# EAGLE schematic schem (EAGLE 9.6.2)
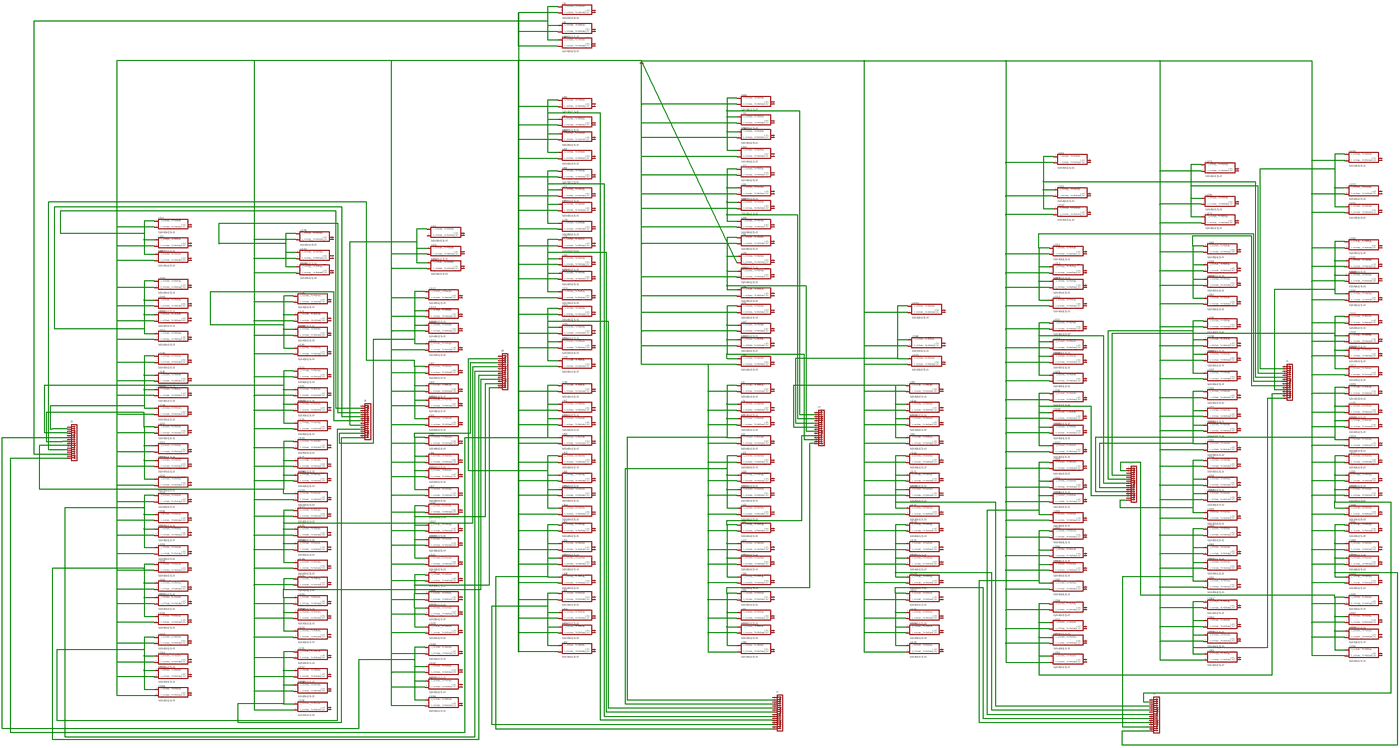
[diagram p0: schematic, sheet 1, overview]
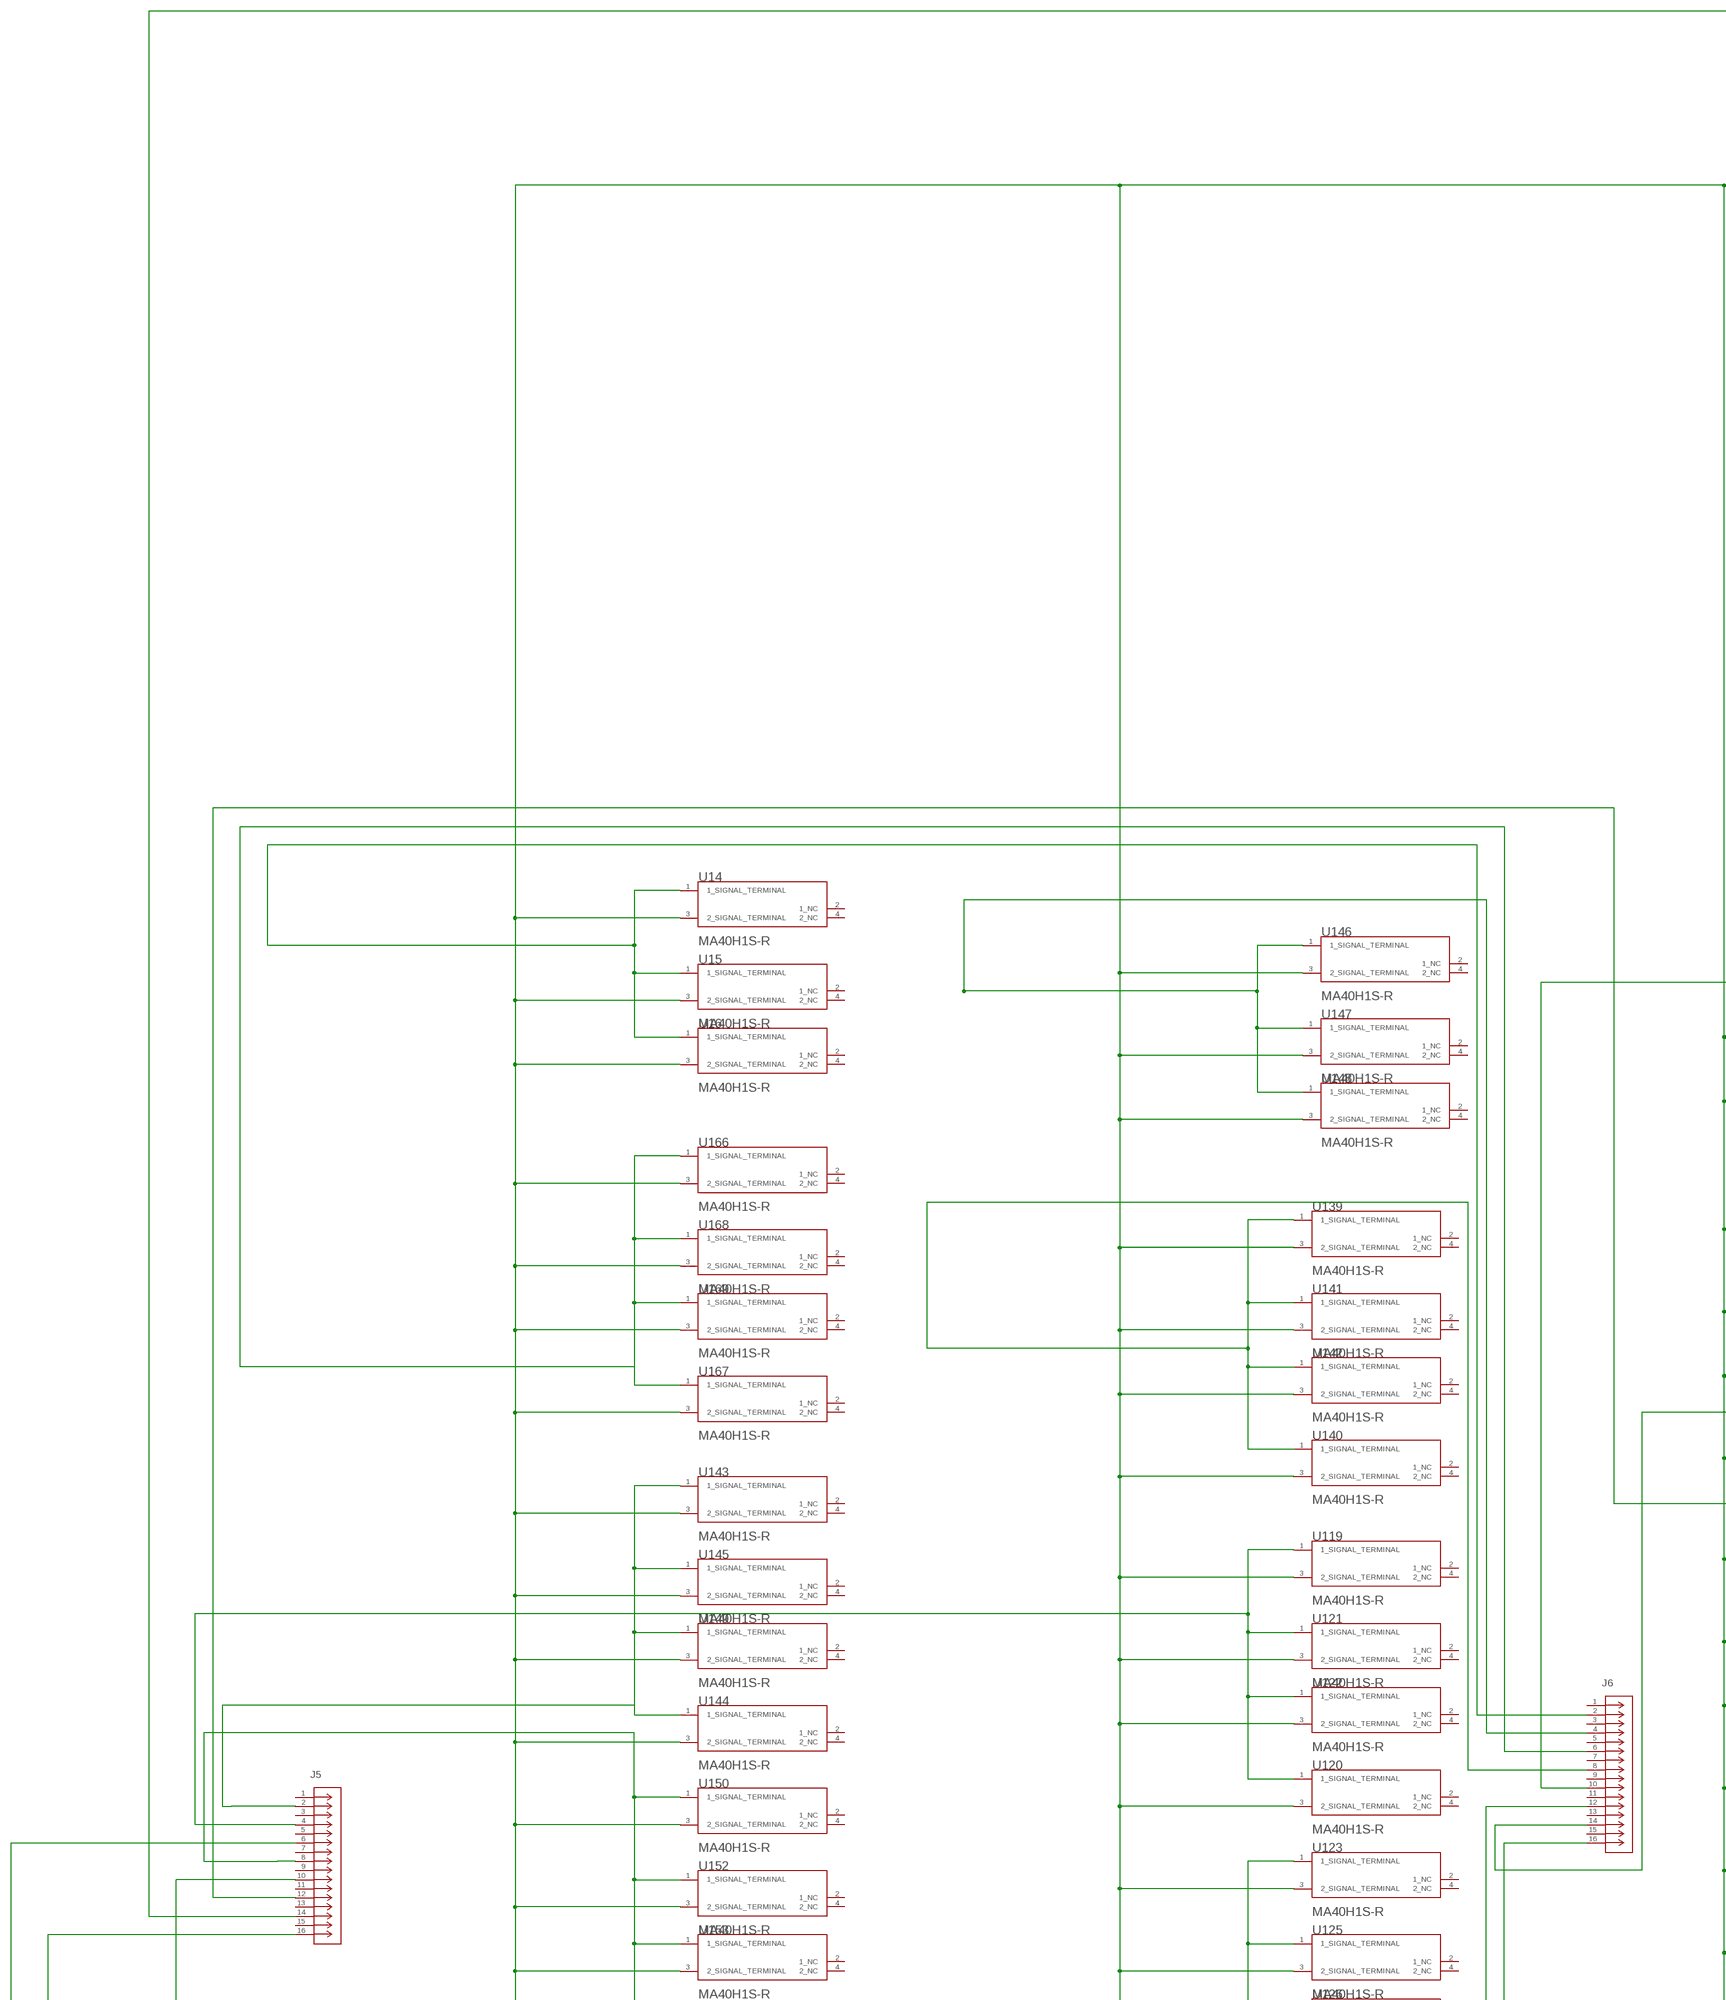
[diagram p1: schematic, sheet 1, part 1 of 8]
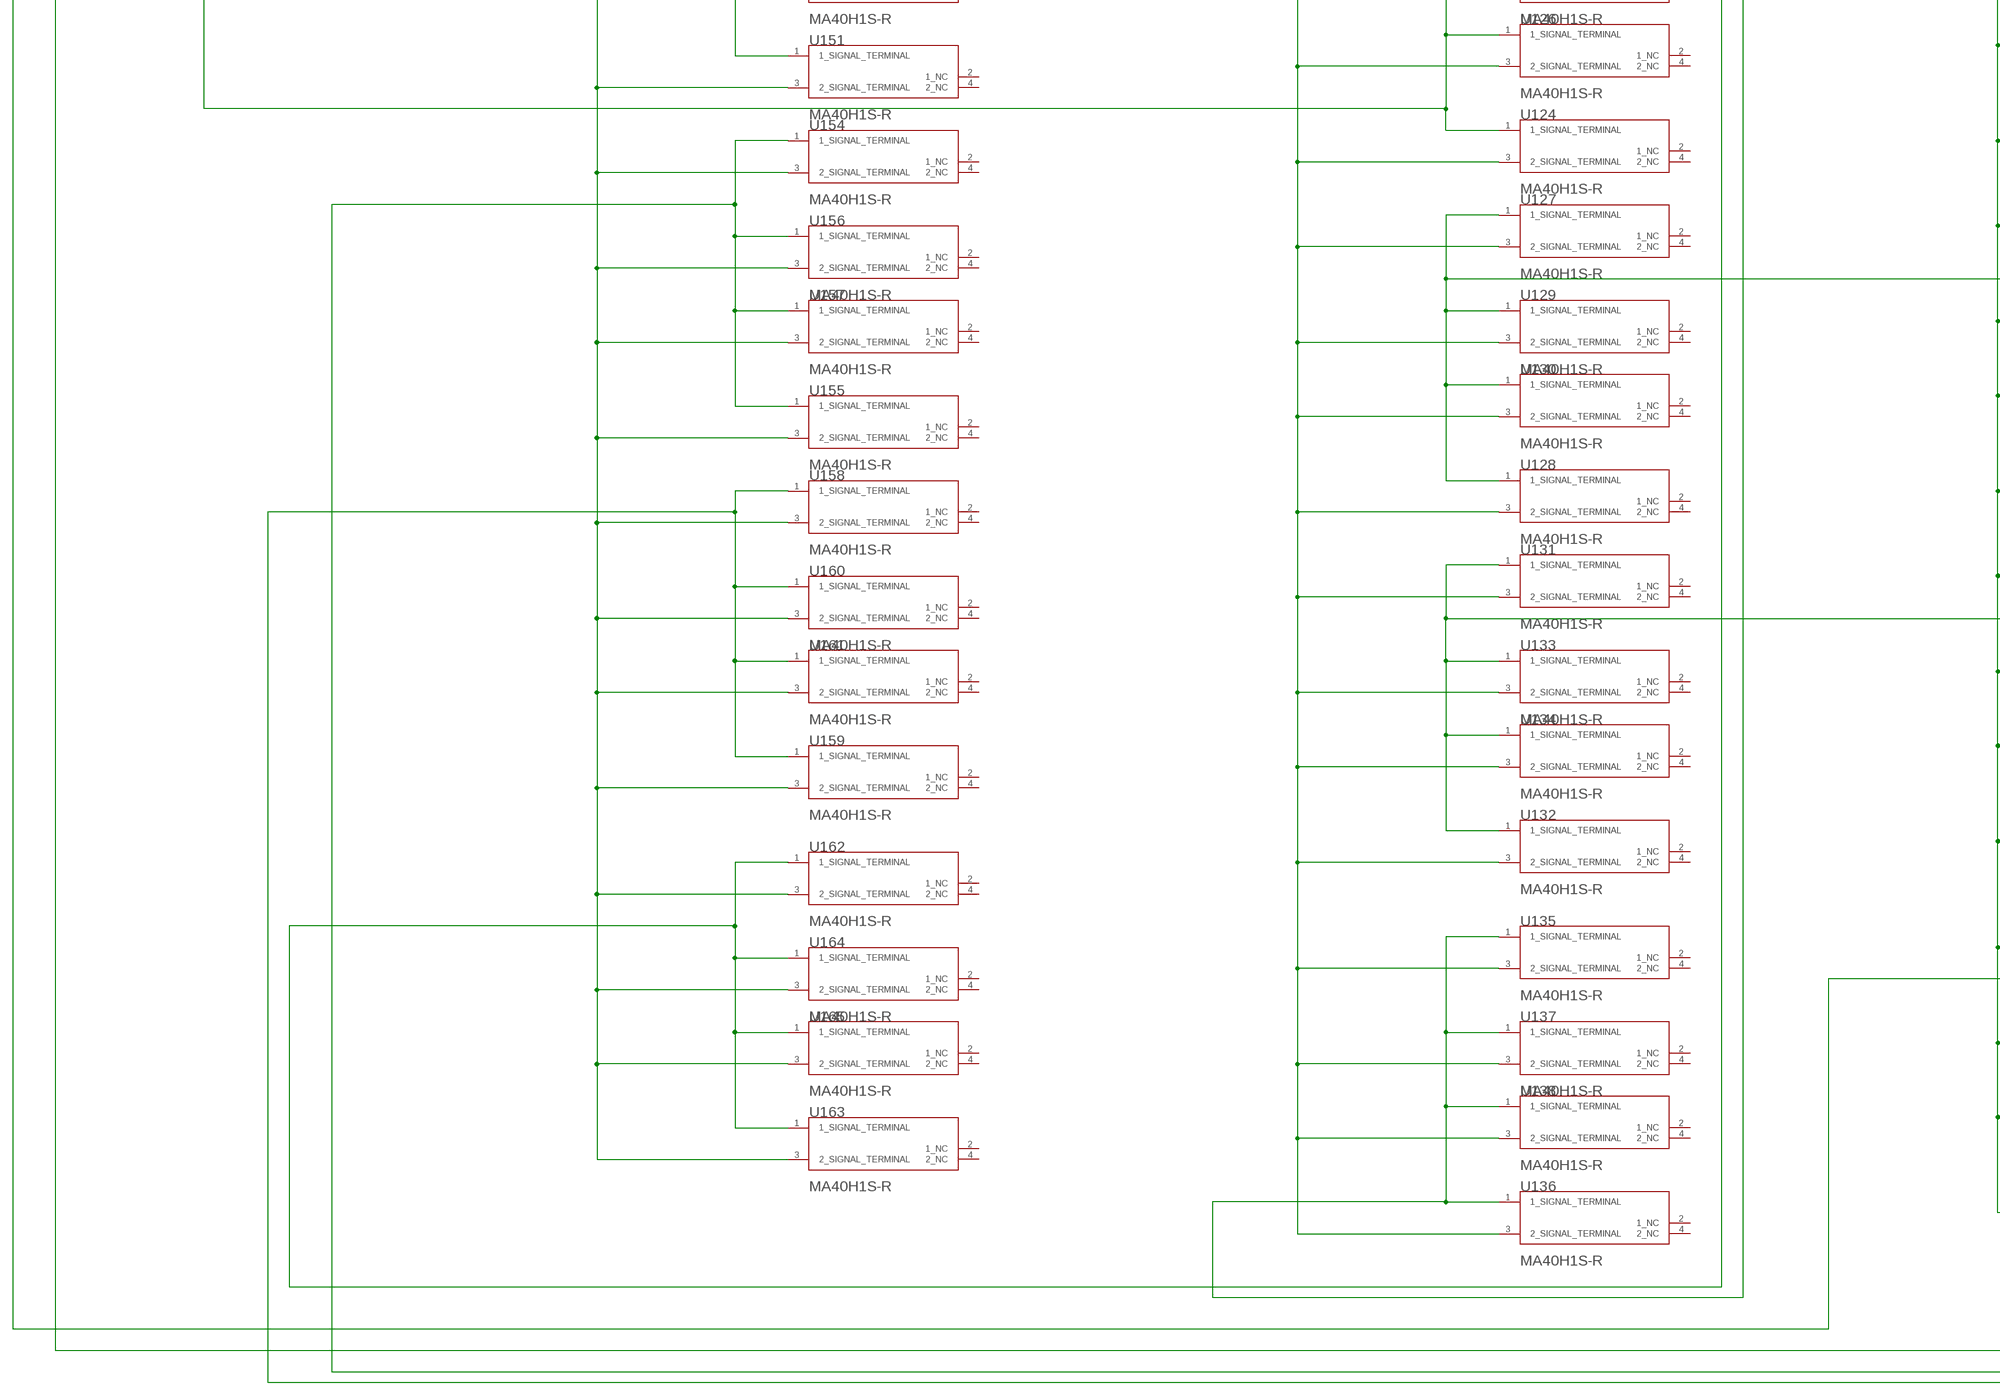
[diagram p2: schematic, sheet 1, part 2 of 8]
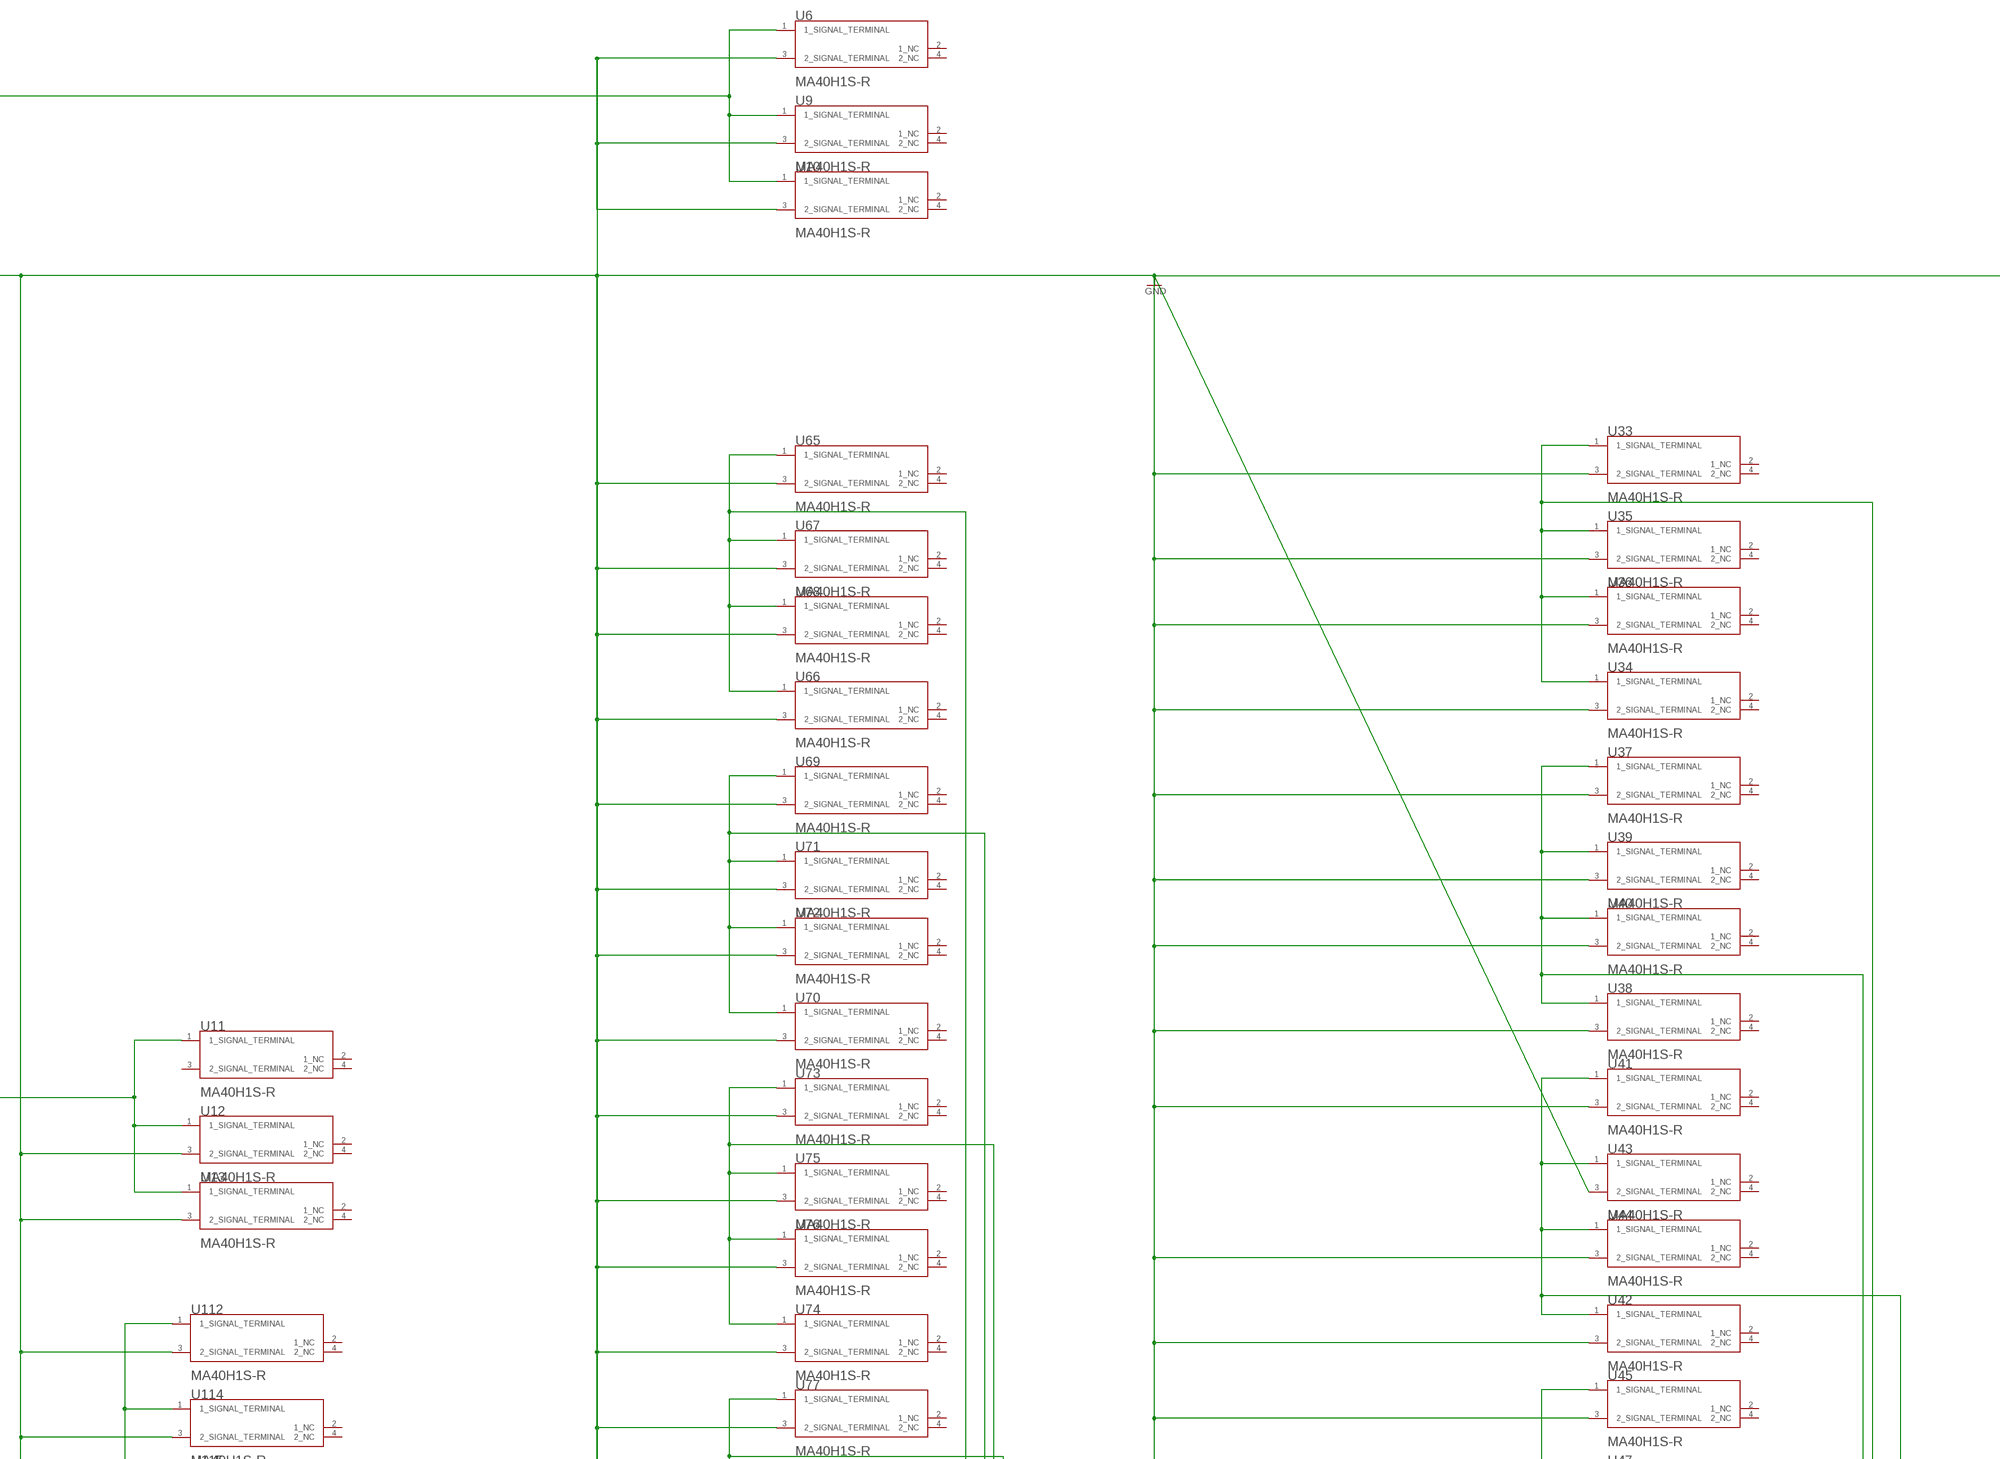
[diagram p3: schematic, sheet 1, part 3 of 8]
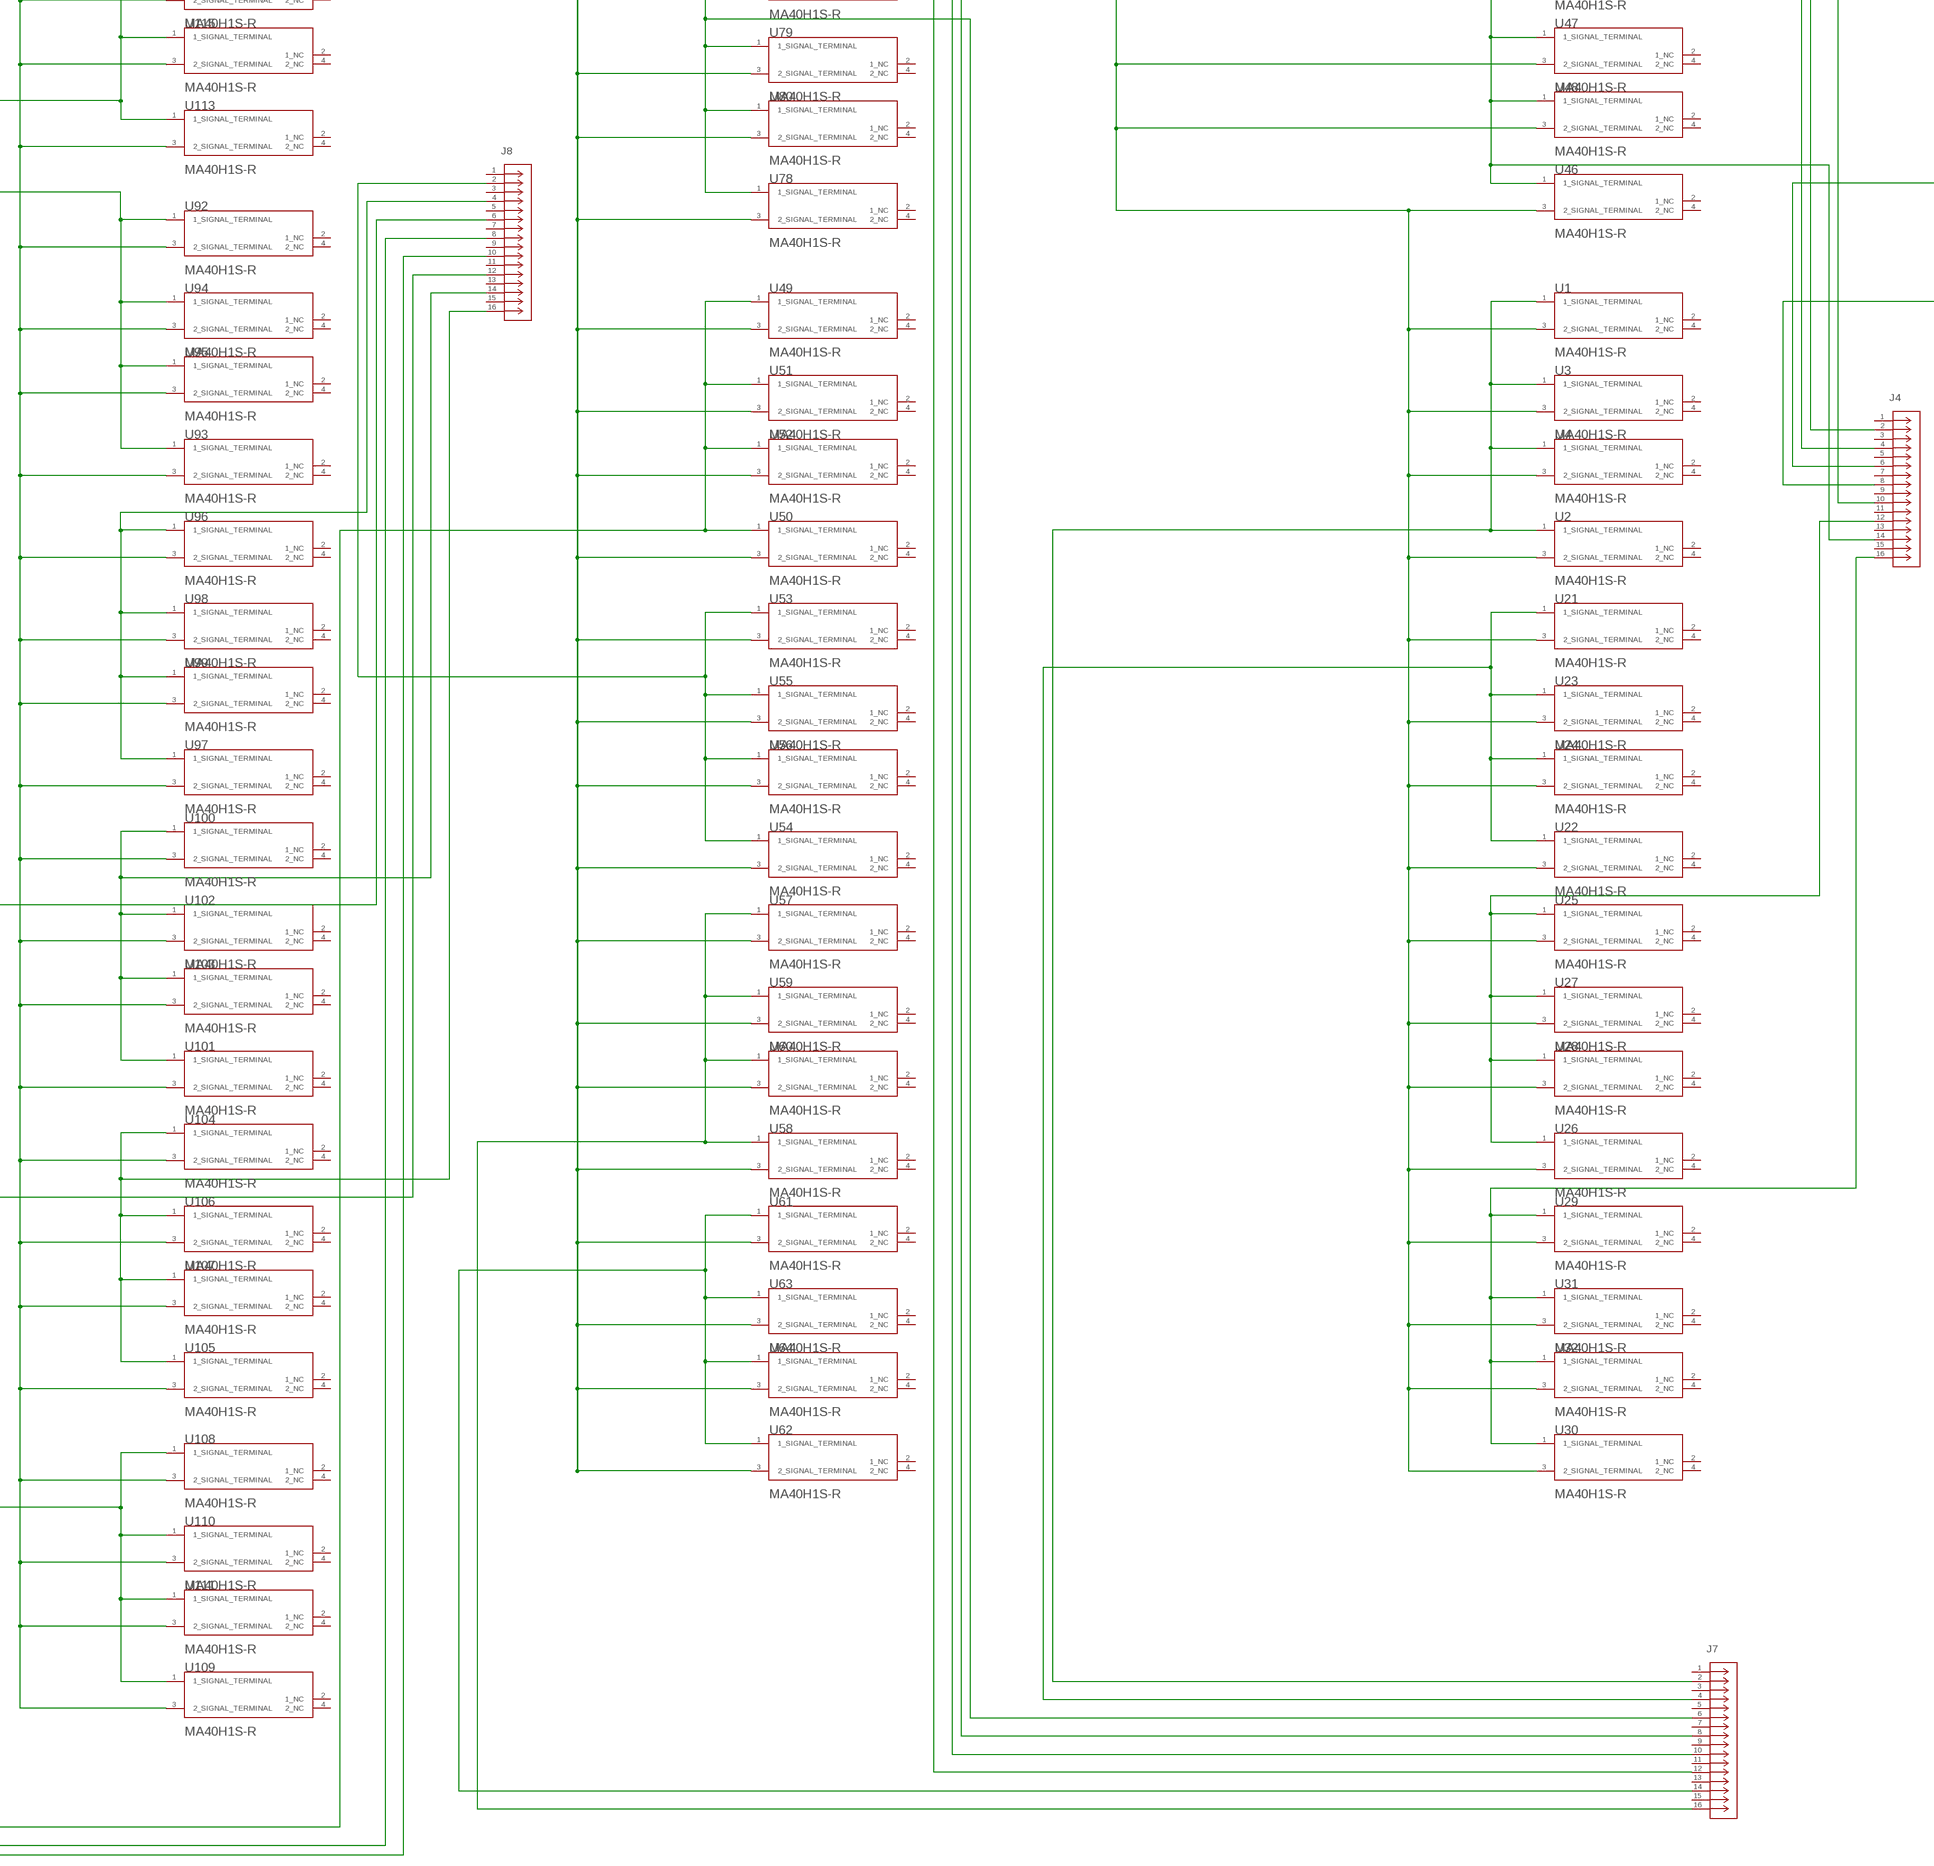
[diagram p4: schematic, sheet 1, part 4 of 8]
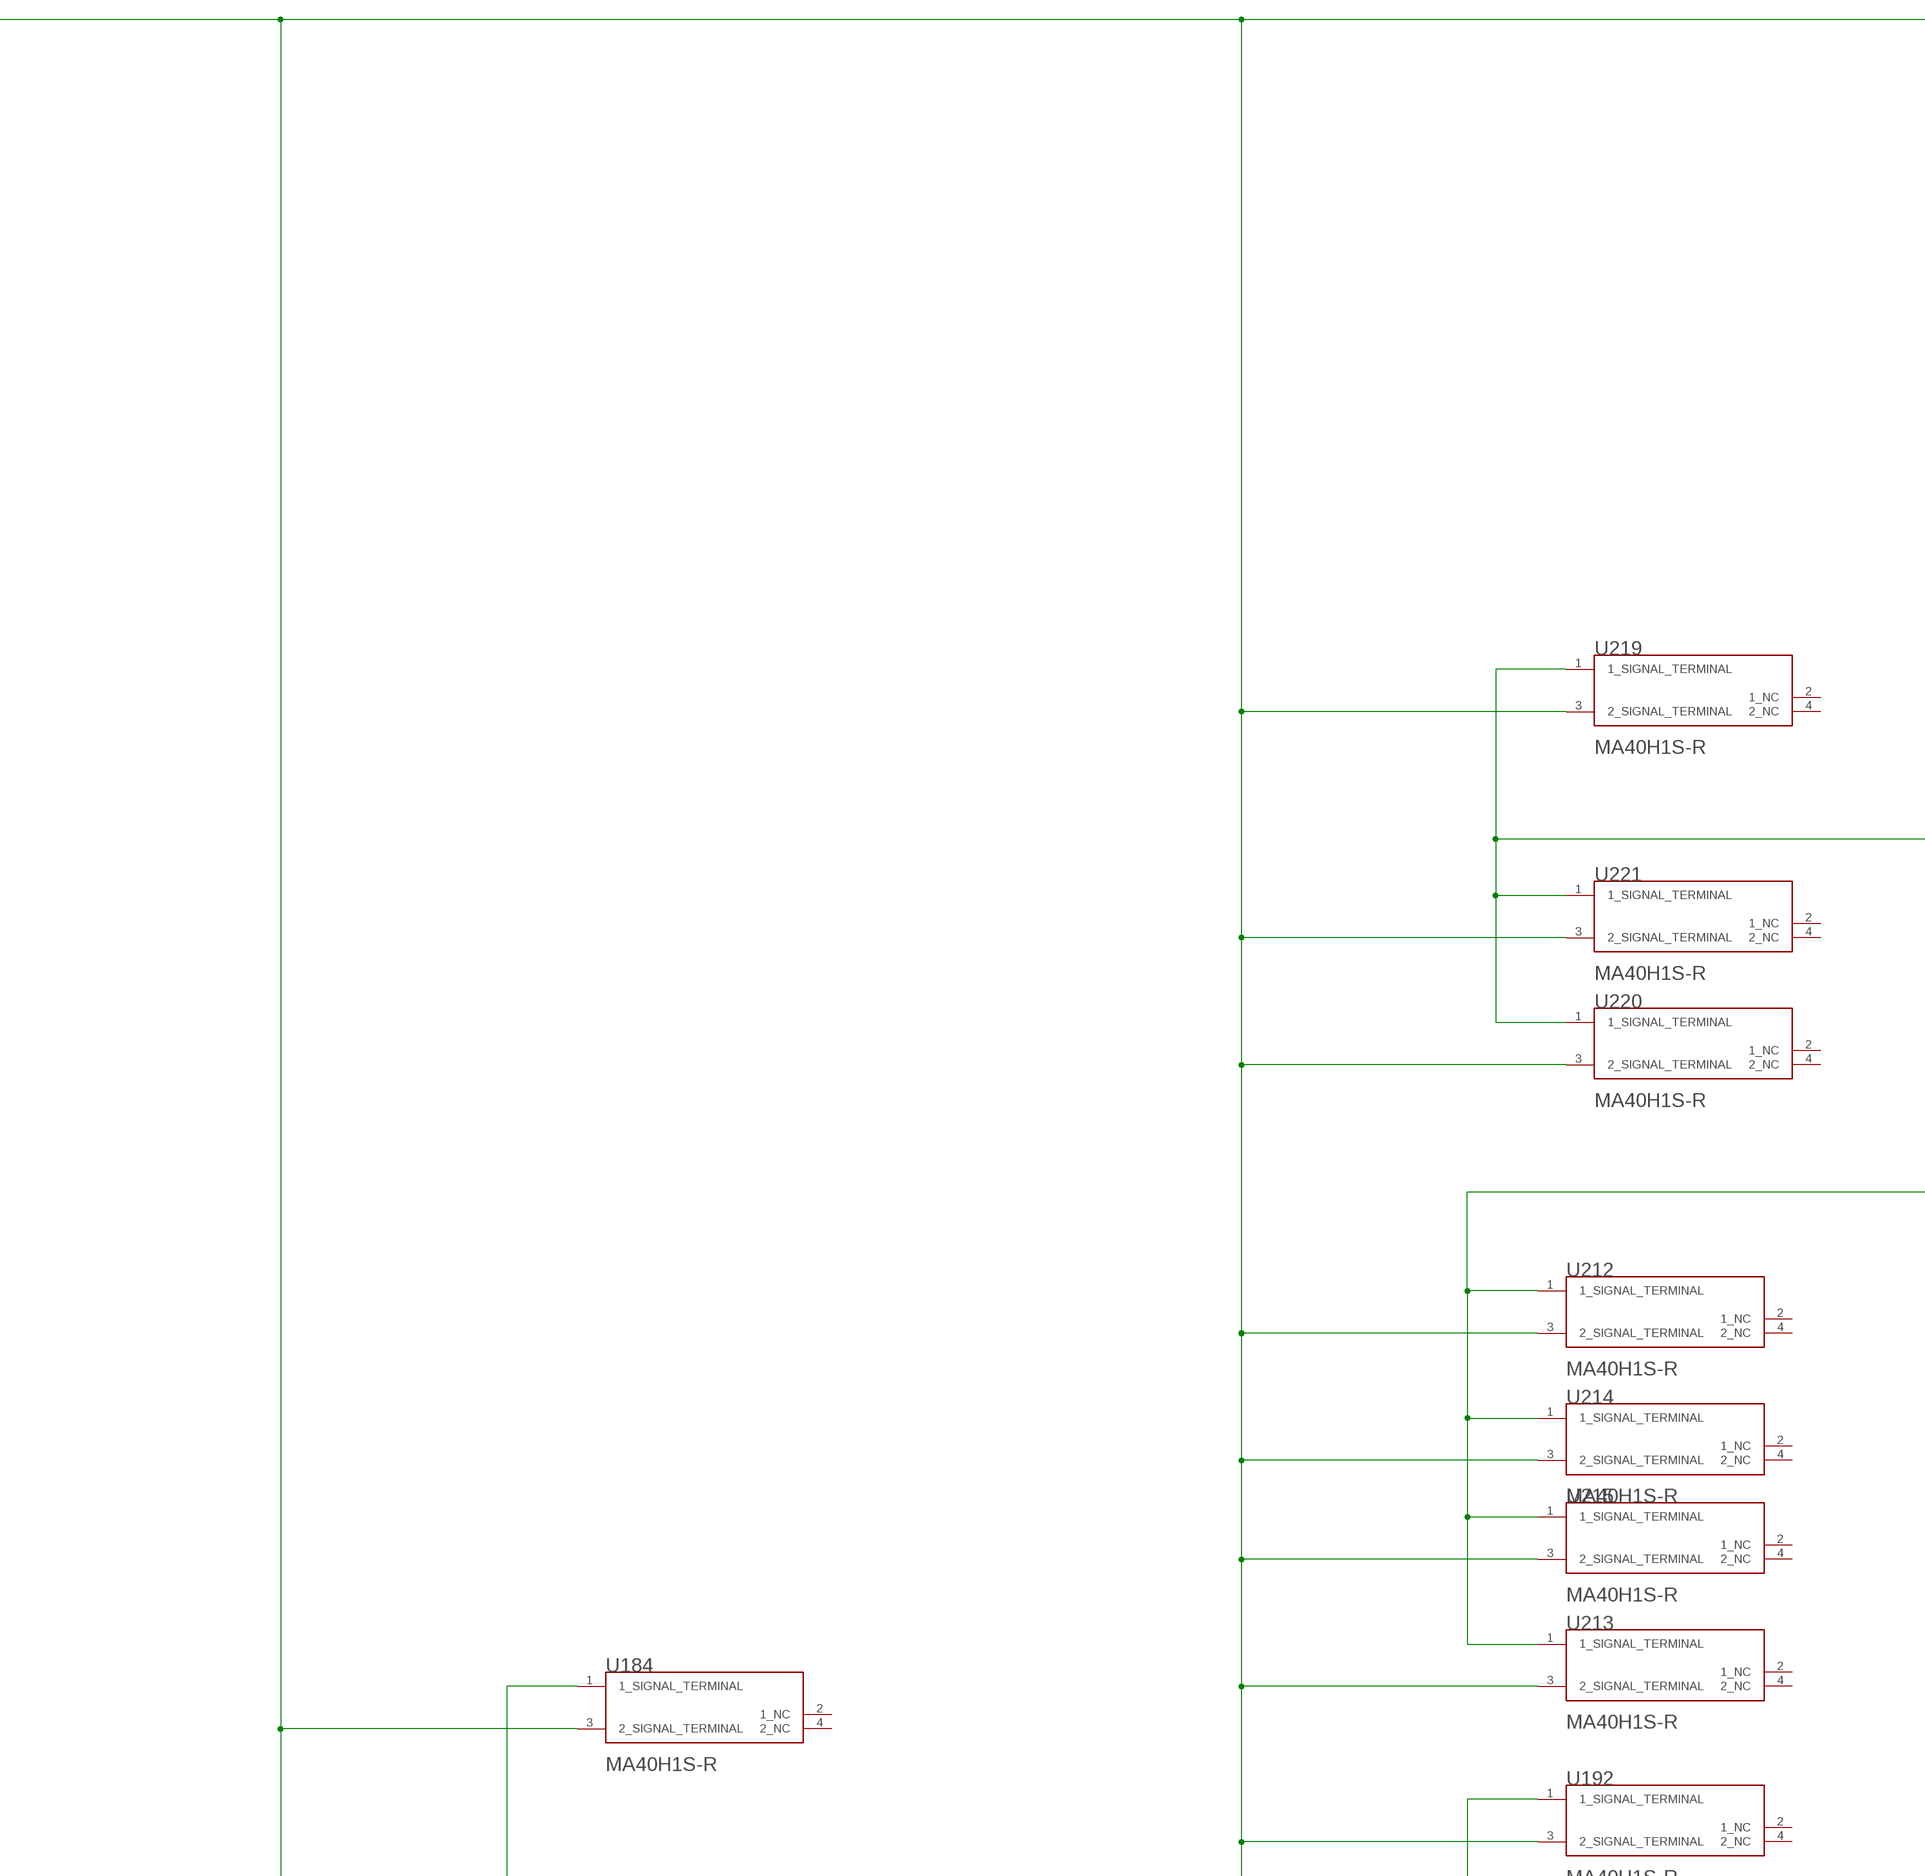
[diagram p5: schematic, sheet 1, part 5 of 8]
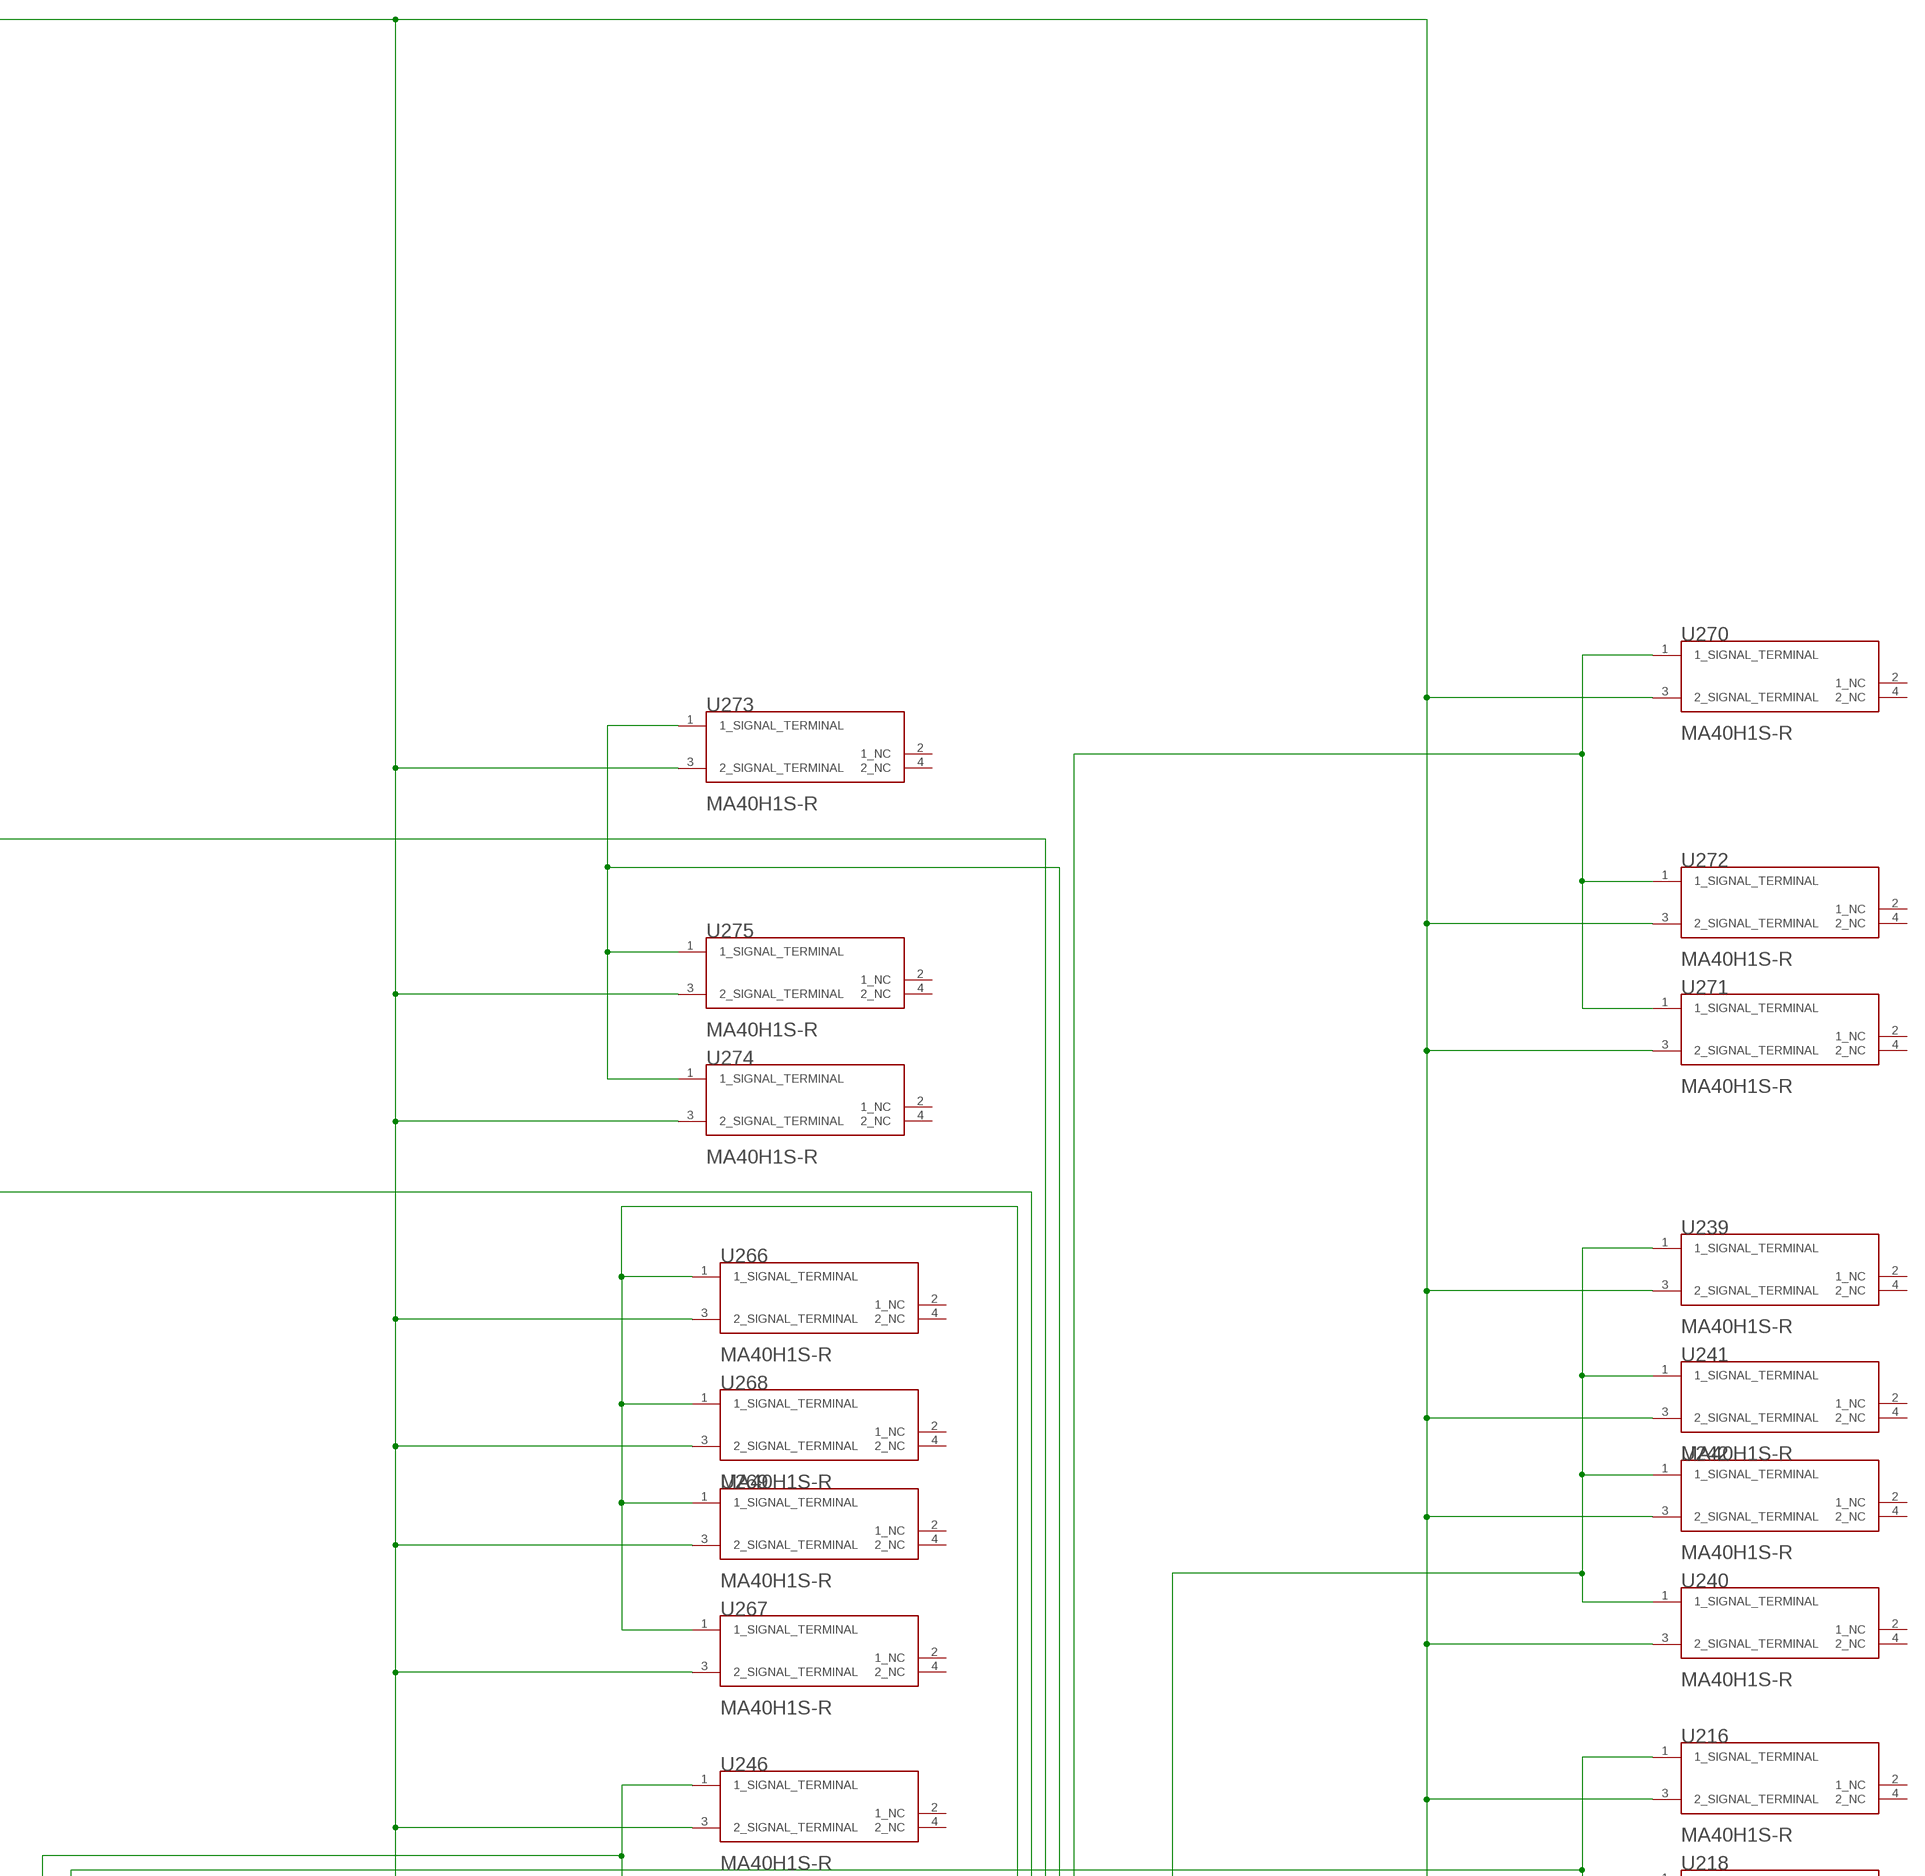
[diagram p6: schematic, sheet 1, part 6 of 8]
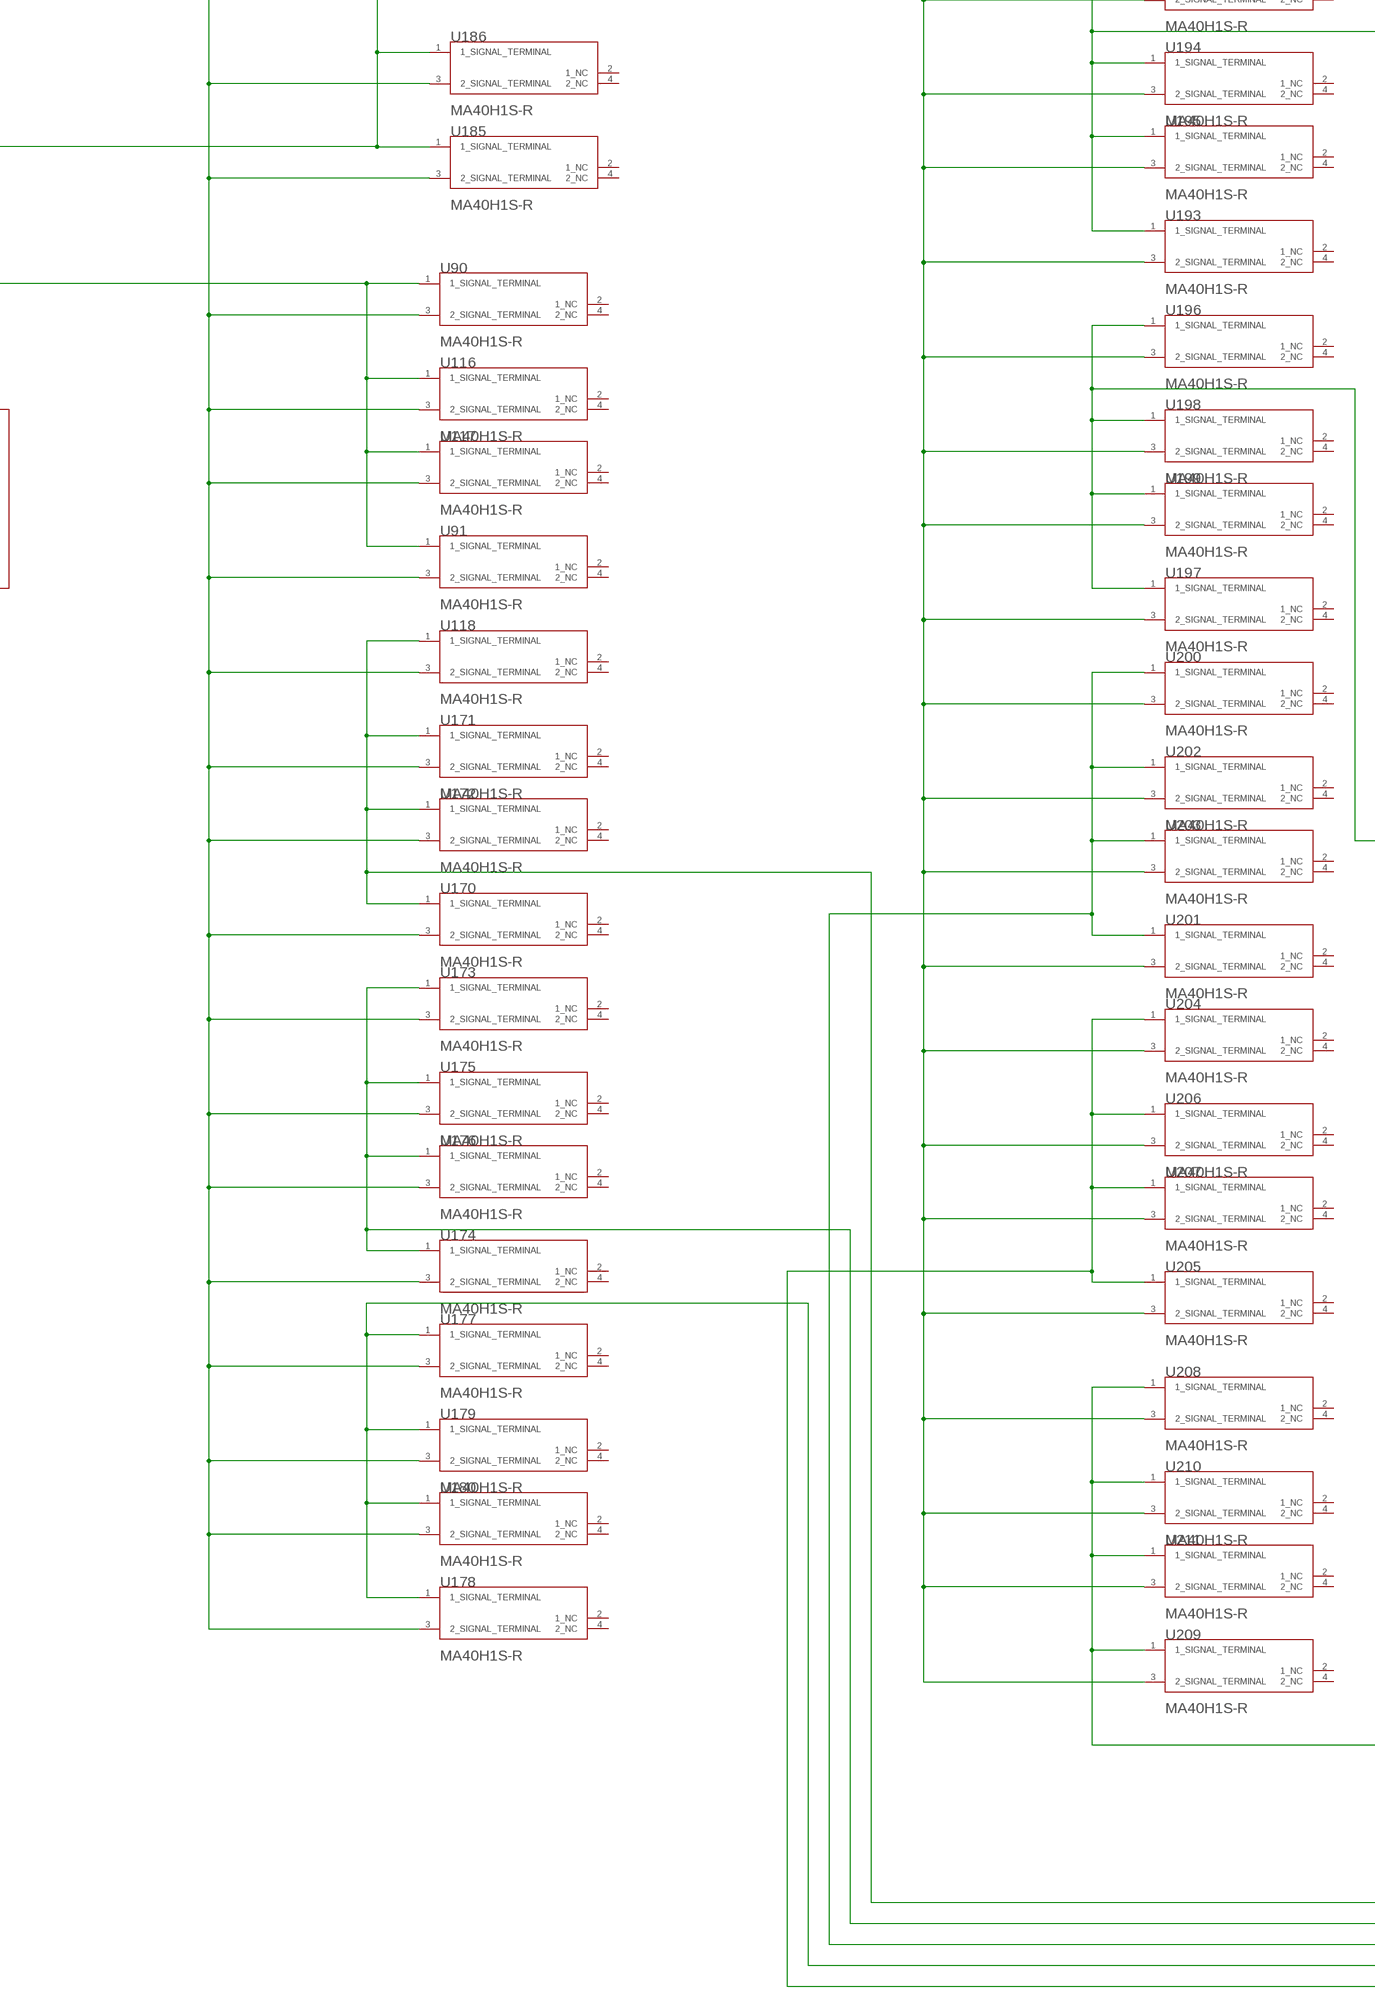
[diagram p7: schematic, sheet 1, part 7 of 8]
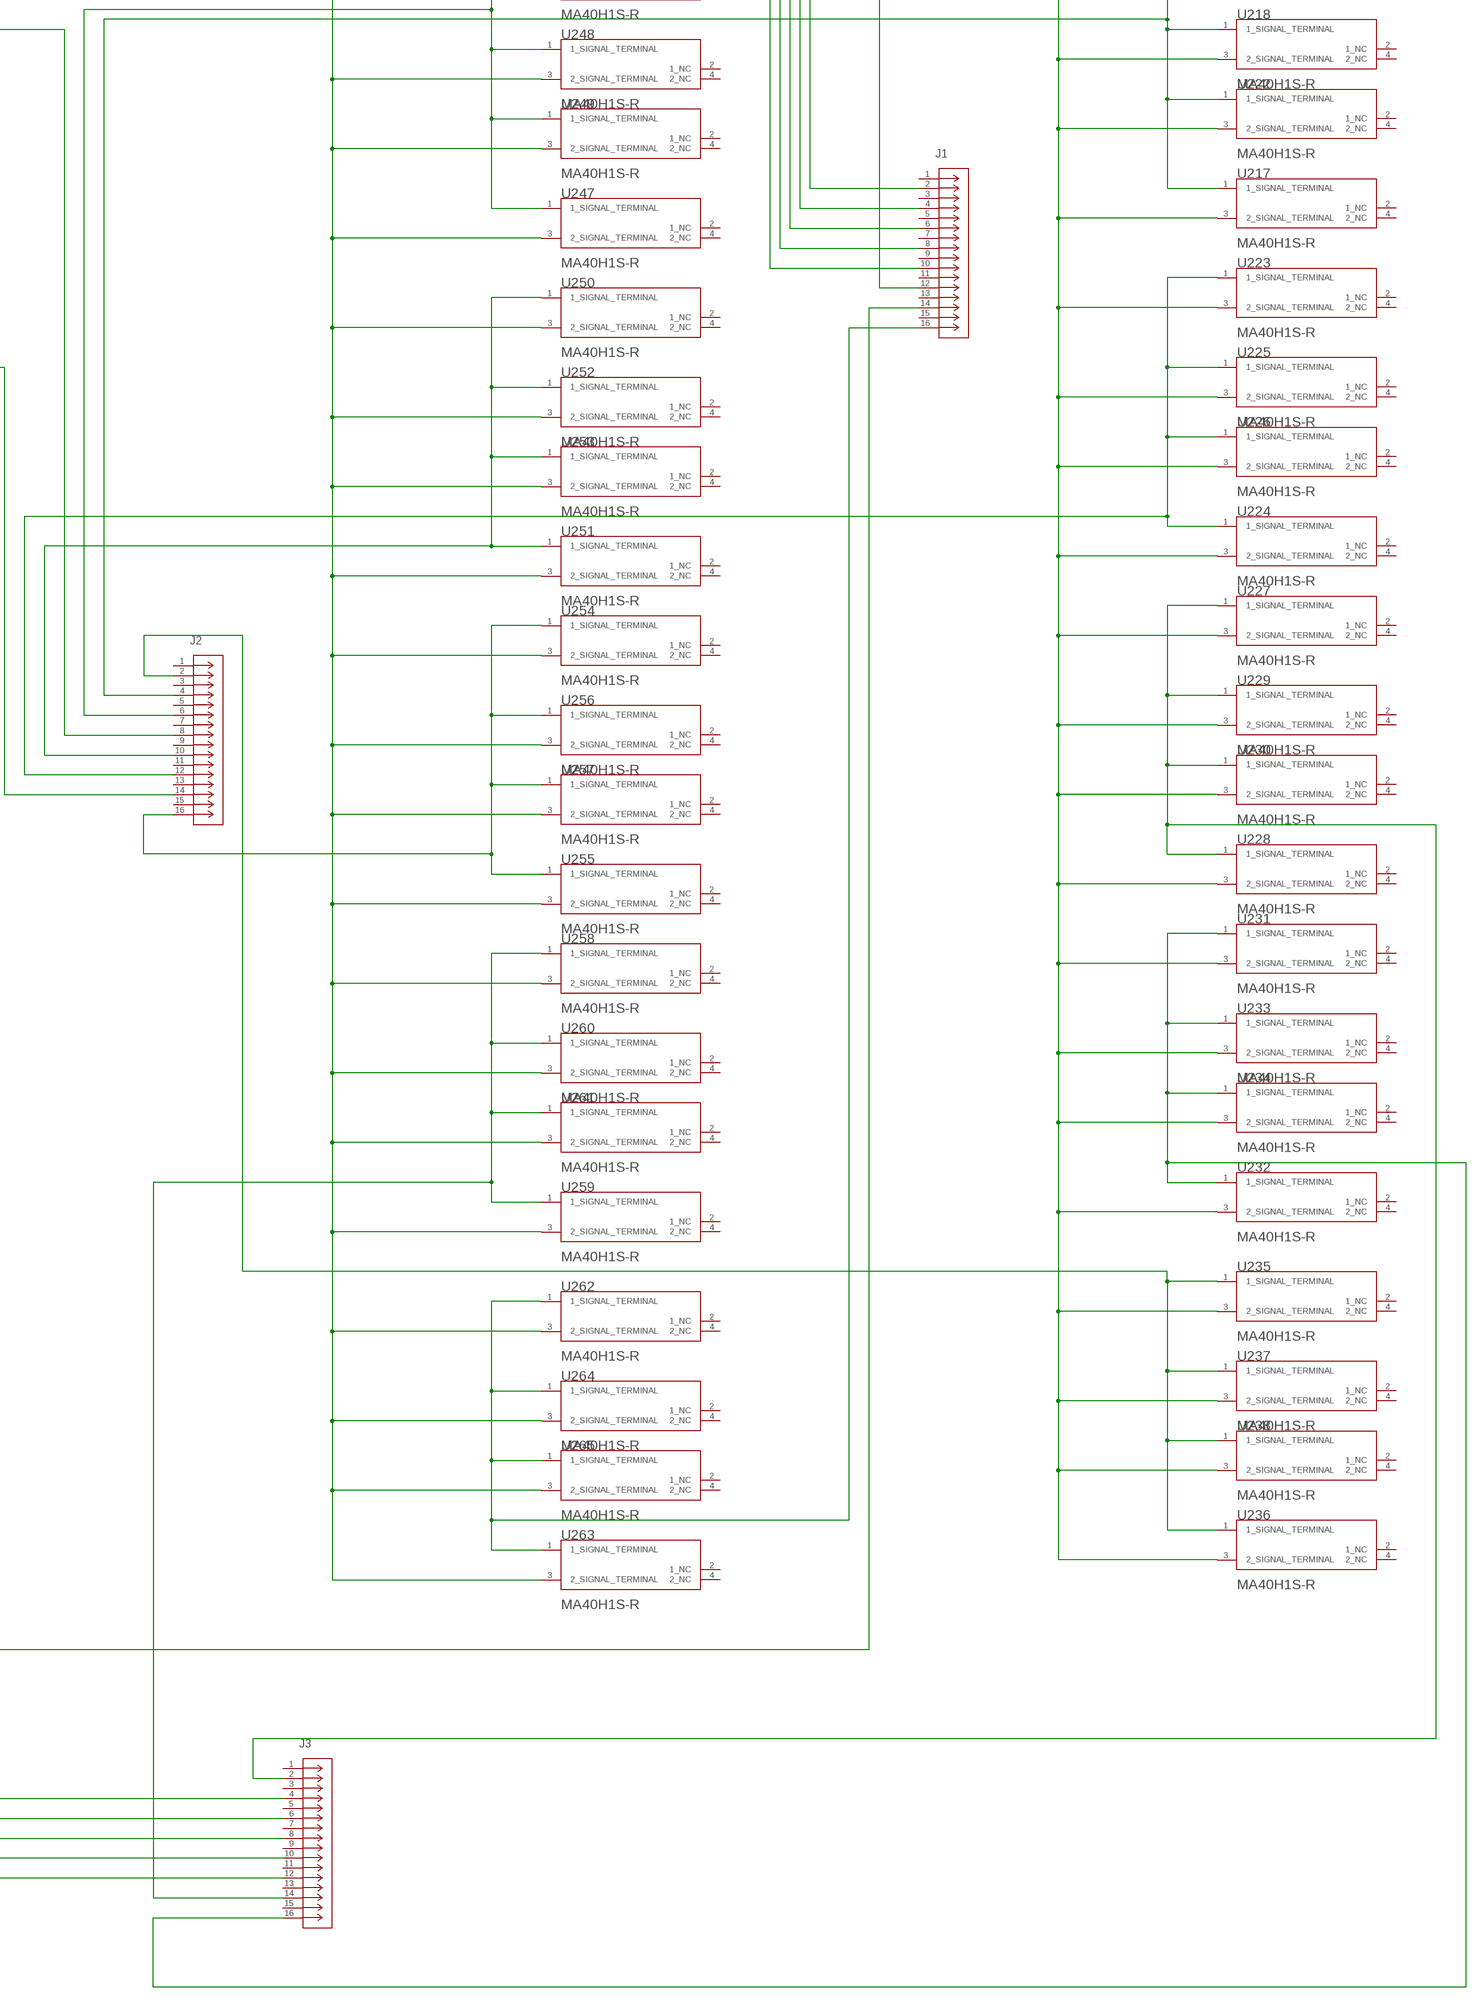
[diagram p8: schematic, sheet 1, part 8 of 8]

## Parts
J1  70246-1201  [CONN_70246-1201_MOL]
J2  70246-1201  [CONN_70246-1201_MOL]
J3  70246-1201  [CONN_70246-1201_MOL]
J4  70246-1201  [CONN_70246-1201_MOL]
J5  70246-1201  [CONN_70246-1201_MOL]
J6  70246-1201  [CONN_70246-1201_MOL]
J7  70246-1201  [CONN_70246-1201_MOL]
J8  70246-1201  [CONN_70246-1201_MOL]
U1  MURATA_MA40H1S-RMURATA_MA40H1S-R_0_0  [MURATA_MA40H1S-R_0]
U2  MURATA_MA40H1S-RMURATA_MA40H1S-R_0_0  [MURATA_MA40H1S-R_0]
U3  MURATA_MA40H1S-RMURATA_MA40H1S-R_0_0  [MURATA_MA40H1S-R_0]
U4  MURATA_MA40H1S-RMURATA_MA40H1S-R_0_0  [MURATA_MA40H1S-R_0]
U6  MURATA_MA40H1S-RMURATA_MA40H1S-R_0_0  [MURATA_MA40H1S-R_0]
U9  MURATA_MA40H1S-RMURATA_MA40H1S-R_0_0  [MURATA_MA40H1S-R_0]
U10  MURATA_MA40H1S-RMURATA_MA40H1S-R_0_0  [MURATA_MA40H1S-R_0]
U11  MURATA_MA40H1S-RMURATA_MA40H1S-R_0_0  [MURATA_MA40H1S-R_0]
U12  MURATA_MA40H1S-RMURATA_MA40H1S-R_0_0  [MURATA_MA40H1S-R_0]
U13  MURATA_MA40H1S-RMURATA_MA40H1S-R_0_0  [MURATA_MA40H1S-R_0]
U14  MURATA_MA40H1S-RMURATA_MA40H1S-R_0_0  [MURATA_MA40H1S-R_0]
U15  MURATA_MA40H1S-RMURATA_MA40H1S-R_0_0  [MURATA_MA40H1S-R_0]
U16  MURATA_MA40H1S-RMURATA_MA40H1S-R_0_0  [MURATA_MA40H1S-R_0]
U21  MURATA_MA40H1S-RMURATA_MA40H1S-R_0_0  [MURATA_MA40H1S-R_0]
U22  MURATA_MA40H1S-RMURATA_MA40H1S-R_0_0  [MURATA_MA40H1S-R_0]
U23  MURATA_MA40H1S-RMURATA_MA40H1S-R_0_0  [MURATA_MA40H1S-R_0]
U24  MURATA_MA40H1S-RMURATA_MA40H1S-R_0_0  [MURATA_MA40H1S-R_0]
U25  MURATA_MA40H1S-RMURATA_MA40H1S-R_0_0  [MURATA_MA40H1S-R_0]
U26  MURATA_MA40H1S-RMURATA_MA40H1S-R_0_0  [MURATA_MA40H1S-R_0]
U27  MURATA_MA40H1S-RMURATA_MA40H1S-R_0_0  [MURATA_MA40H1S-R_0]
U28  MURATA_MA40H1S-RMURATA_MA40H1S-R_0_0  [MURATA_MA40H1S-R_0]
U29  MURATA_MA40H1S-RMURATA_MA40H1S-R_0_0  [MURATA_MA40H1S-R_0]
U30  MURATA_MA40H1S-RMURATA_MA40H1S-R_0_0  [MURATA_MA40H1S-R_0]
U31  MURATA_MA40H1S-RMURATA_MA40H1S-R_0_0  [MURATA_MA40H1S-R_0]
U32  MURATA_MA40H1S-RMURATA_MA40H1S-R_0_0  [MURATA_MA40H1S-R_0]
U33  MURATA_MA40H1S-RMURATA_MA40H1S-R_0_0  [MURATA_MA40H1S-R_0]
U34  MURATA_MA40H1S-RMURATA_MA40H1S-R_0_0  [MURATA_MA40H1S-R_0]
U35  MURATA_MA40H1S-RMURATA_MA40H1S-R_0_0  [MURATA_MA40H1S-R_0]
U36  MURATA_MA40H1S-RMURATA_MA40H1S-R_0_0  [MURATA_MA40H1S-R_0]
U37  MURATA_MA40H1S-RMURATA_MA40H1S-R_0_0  [MURATA_MA40H1S-R_0]
U38  MURATA_MA40H1S-RMURATA_MA40H1S-R_0_0  [MURATA_MA40H1S-R_0]
U39  MURATA_MA40H1S-RMURATA_MA40H1S-R_0_0  [MURATA_MA40H1S-R_0]
U40  MURATA_MA40H1S-RMURATA_MA40H1S-R_0_0  [MURATA_MA40H1S-R_0]
U41  MURATA_MA40H1S-RMURATA_MA40H1S-R_0_0  [MURATA_MA40H1S-R_0]
U42  MURATA_MA40H1S-RMURATA_MA40H1S-R_0_0  [MURATA_MA40H1S-R_0]
U43  MURATA_MA40H1S-RMURATA_MA40H1S-R_0_0  [MURATA_MA40H1S-R_0]
U44  MURATA_MA40H1S-RMURATA_MA40H1S-R_0_0  [MURATA_MA40H1S-R_0]
U45  MURATA_MA40H1S-RMURATA_MA40H1S-R_0_0  [MURATA_MA40H1S-R_0]
U46  MURATA_MA40H1S-RMURATA_MA40H1S-R_0_0  [MURATA_MA40H1S-R_0]
U47  MURATA_MA40H1S-RMURATA_MA40H1S-R_0_0  [MURATA_MA40H1S-R_0]
U48  MURATA_MA40H1S-RMURATA_MA40H1S-R_0_0  [MURATA_MA40H1S-R_0]
U49  MURATA_MA40H1S-RMURATA_MA40H1S-R_0_0  [MURATA_MA40H1S-R_0]
U50  MURATA_MA40H1S-RMURATA_MA40H1S-R_0_0  [MURATA_MA40H1S-R_0]
U51  MURATA_MA40H1S-RMURATA_MA40H1S-R_0_0  [MURATA_MA40H1S-R_0]
U52  MURATA_MA40H1S-RMURATA_MA40H1S-R_0_0  [MURATA_MA40H1S-R_0]
U53  MURATA_MA40H1S-RMURATA_MA40H1S-R_0_0  [MURATA_MA40H1S-R_0]
U54  MURATA_MA40H1S-RMURATA_MA40H1S-R_0_0  [MURATA_MA40H1S-R_0]
U55  MURATA_MA40H1S-RMURATA_MA40H1S-R_0_0  [MURATA_MA40H1S-R_0]
U56  MURATA_MA40H1S-RMURATA_MA40H1S-R_0_0  [MURATA_MA40H1S-R_0]
U57  MURATA_MA40H1S-RMURATA_MA40H1S-R_0_0  [MURATA_MA40H1S-R_0]
U58  MURATA_MA40H1S-RMURATA_MA40H1S-R_0_0  [MURATA_MA40H1S-R_0]
U59  MURATA_MA40H1S-RMURATA_MA40H1S-R_0_0  [MURATA_MA40H1S-R_0]
U60  MURATA_MA40H1S-RMURATA_MA40H1S-R_0_0  [MURATA_MA40H1S-R_0]
U61  MURATA_MA40H1S-RMURATA_MA40H1S-R_0_0  [MURATA_MA40H1S-R_0]
U62  MURATA_MA40H1S-RMURATA_MA40H1S-R_0_0  [MURATA_MA40H1S-R_0]
U63  MURATA_MA40H1S-RMURATA_MA40H1S-R_0_0  [MURATA_MA40H1S-R_0]
U64  MURATA_MA40H1S-RMURATA_MA40H1S-R_0_0  [MURATA_MA40H1S-R_0]
U65  MURATA_MA40H1S-RMURATA_MA40H1S-R_0_0  [MURATA_MA40H1S-R_0]
U66  MURATA_MA40H1S-RMURATA_MA40H1S-R_0_0  [MURATA_MA40H1S-R_0]
U67  MURATA_MA40H1S-RMURATA_MA40H1S-R_0_0  [MURATA_MA40H1S-R_0]
U68  MURATA_MA40H1S-RMURATA_MA40H1S-R_0_0  [MURATA_MA40H1S-R_0]
U69  MURATA_MA40H1S-RMURATA_MA40H1S-R_0_0  [MURATA_MA40H1S-R_0]
U70  MURATA_MA40H1S-RMURATA_MA40H1S-R_0_0  [MURATA_MA40H1S-R_0]
U71  MURATA_MA40H1S-RMURATA_MA40H1S-R_0_0  [MURATA_MA40H1S-R_0]
U72  MURATA_MA40H1S-RMURATA_MA40H1S-R_0_0  [MURATA_MA40H1S-R_0]
U73  MURATA_MA40H1S-RMURATA_MA40H1S-R_0_0  [MURATA_MA40H1S-R_0]
U74  MURATA_MA40H1S-RMURATA_MA40H1S-R_0_0  [MURATA_MA40H1S-R_0]
U75  MURATA_MA40H1S-RMURATA_MA40H1S-R_0_0  [MURATA_MA40H1S-R_0]
U76  MURATA_MA40H1S-RMURATA_MA40H1S-R_0_0  [MURATA_MA40H1S-R_0]
U77  MURATA_MA40H1S-RMURATA_MA40H1S-R_0_0  [MURATA_MA40H1S-R_0]
U78  MURATA_MA40H1S-RMURATA_MA40H1S-R_0_0  [MURATA_MA40H1S-R_0]
U79  MURATA_MA40H1S-RMURATA_MA40H1S-R_0_0  [MURATA_MA40H1S-R_0]
U80  MURATA_MA40H1S-RMURATA_MA40H1S-R_0_0  [MURATA_MA40H1S-R_0]
U90  MURATA_MA40H1S-RMURATA_MA40H1S-R_0_0  [MURATA_MA40H1S-R_0]
U91  MURATA_MA40H1S-RMURATA_MA40H1S-R_0_0  [MURATA_MA40H1S-R_0]
U92  MURATA_MA40H1S-RMURATA_MA40H1S-R_0_0  [MURATA_MA40H1S-R_0]
U93  MURATA_MA40H1S-RMURATA_MA40H1S-R_0_0  [MURATA_MA40H1S-R_0]
U94  MURATA_MA40H1S-RMURATA_MA40H1S-R_0_0  [MURATA_MA40H1S-R_0]
U95  MURATA_MA40H1S-RMURATA_MA40H1S-R_0_0  [MURATA_MA40H1S-R_0]
U96  MURATA_MA40H1S-RMURATA_MA40H1S-R_0_0  [MURATA_MA40H1S-R_0]
U97  MURATA_MA40H1S-RMURATA_MA40H1S-R_0_0  [MURATA_MA40H1S-R_0]
U98  MURATA_MA40H1S-RMURATA_MA40H1S-R_0_0  [MURATA_MA40H1S-R_0]
U99  MURATA_MA40H1S-RMURATA_MA40H1S-R_0_0  [MURATA_MA40H1S-R_0]
U100  MURATA_MA40H1S-RMURATA_MA40H1S-R_0_0  [MURATA_MA40H1S-R_0]
U101  MURATA_MA40H1S-RMURATA_MA40H1S-R_0_0  [MURATA_MA40H1S-R_0]
U102  MURATA_MA40H1S-RMURATA_MA40H1S-R_0_0  [MURATA_MA40H1S-R_0]
U103  MURATA_MA40H1S-RMURATA_MA40H1S-R_0_0  [MURATA_MA40H1S-R_0]
U104  MURATA_MA40H1S-RMURATA_MA40H1S-R_0_0  [MURATA_MA40H1S-R_0]
U105  MURATA_MA40H1S-RMURATA_MA40H1S-R_0_0  [MURATA_MA40H1S-R_0]
U106  MURATA_MA40H1S-RMURATA_MA40H1S-R_0_0  [MURATA_MA40H1S-R_0]
U107  MURATA_MA40H1S-RMURATA_MA40H1S-R_0_0  [MURATA_MA40H1S-R_0]
U108  MURATA_MA40H1S-RMURATA_MA40H1S-R_0_0  [MURATA_MA40H1S-R_0]
U109  MURATA_MA40H1S-RMURATA_MA40H1S-R_0_0  [MURATA_MA40H1S-R_0]
U110  MURATA_MA40H1S-RMURATA_MA40H1S-R_0_0  [MURATA_MA40H1S-R_0]
U111  MURATA_MA40H1S-RMURATA_MA40H1S-R_0_0  [MURATA_MA40H1S-R_0]
U112  MURATA_MA40H1S-RMURATA_MA40H1S-R_0_0  [MURATA_MA40H1S-R_0]
U113  MURATA_MA40H1S-RMURATA_MA40H1S-R_0_0  [MURATA_MA40H1S-R_0]
U114  MURATA_MA40H1S-RMURATA_MA40H1S-R_0_0  [MURATA_MA40H1S-R_0]
U115  MURATA_MA40H1S-RMURATA_MA40H1S-R_0_0  [MURATA_MA40H1S-R_0]
U116  MURATA_MA40H1S-RMURATA_MA40H1S-R_0_0  [MURATA_MA40H1S-R_0]
U117  MURATA_MA40H1S-RMURATA_MA40H1S-R_0_0  [MURATA_MA40H1S-R_0]
U118  MURATA_MA40H1S-RMURATA_MA40H1S-R_0_0  [MURATA_MA40H1S-R_0]
U119  MURATA_MA40H1S-RMURATA_MA40H1S-R_0_0  [MURATA_MA40H1S-R_0]
U120  MURATA_MA40H1S-RMURATA_MA40H1S-R_0_0  [MURATA_MA40H1S-R_0]
U121  MURATA_MA40H1S-RMURATA_MA40H1S-R_0_0  [MURATA_MA40H1S-R_0]
U122  MURATA_MA40H1S-RMURATA_MA40H1S-R_0_0  [MURATA_MA40H1S-R_0]
U123  MURATA_MA40H1S-RMURATA_MA40H1S-R_0_0  [MURATA_MA40H1S-R_0]
U124  MURATA_MA40H1S-RMURATA_MA40H1S-R_0_0  [MURATA_MA40H1S-R_0]
U125  MURATA_MA40H1S-RMURATA_MA40H1S-R_0_0  [MURATA_MA40H1S-R_0]
U126  MURATA_MA40H1S-RMURATA_MA40H1S-R_0_0  [MURATA_MA40H1S-R_0]
U127  MURATA_MA40H1S-RMURATA_MA40H1S-R_0_0  [MURATA_MA40H1S-R_0]
U128  MURATA_MA40H1S-RMURATA_MA40H1S-R_0_0  [MURATA_MA40H1S-R_0]
U129  MURATA_MA40H1S-RMURATA_MA40H1S-R_0_0  [MURATA_MA40H1S-R_0]
U130  MURATA_MA40H1S-RMURATA_MA40H1S-R_0_0  [MURATA_MA40H1S-R_0]
U131  MURATA_MA40H1S-RMURATA_MA40H1S-R_0_0  [MURATA_MA40H1S-R_0]
U132  MURATA_MA40H1S-RMURATA_MA40H1S-R_0_0  [MURATA_MA40H1S-R_0]
U133  MURATA_MA40H1S-RMURATA_MA40H1S-R_0_0  [MURATA_MA40H1S-R_0]
U134  MURATA_MA40H1S-RMURATA_MA40H1S-R_0_0  [MURATA_MA40H1S-R_0]
U135  MURATA_MA40H1S-RMURATA_MA40H1S-R_0_0  [MURATA_MA40H1S-R_0]
U136  MURATA_MA40H1S-RMURATA_MA40H1S-R_0_0  [MURATA_MA40H1S-R_0]
U137  MURATA_MA40H1S-RMURATA_MA40H1S-R_0_0  [MURATA_MA40H1S-R_0]
U138  MURATA_MA40H1S-RMURATA_MA40H1S-R_0_0  [MURATA_MA40H1S-R_0]
U139  MURATA_MA40H1S-RMURATA_MA40H1S-R_0_0  [MURATA_MA40H1S-R_0]
U140  MURATA_MA40H1S-RMURATA_MA40H1S-R_0_0  [MURATA_MA40H1S-R_0]
U141  MURATA_MA40H1S-RMURATA_MA40H1S-R_0_0  [MURATA_MA40H1S-R_0]
U142  MURATA_MA40H1S-RMURATA_MA40H1S-R_0_0  [MURATA_MA40H1S-R_0]
U143  MURATA_MA40H1S-RMURATA_MA40H1S-R_0_0  [MURATA_MA40H1S-R_0]
U144  MURATA_MA40H1S-RMURATA_MA40H1S-R_0_0  [MURATA_MA40H1S-R_0]
U145  MURATA_MA40H1S-RMURATA_MA40H1S-R_0_0  [MURATA_MA40H1S-R_0]
U146  MURATA_MA40H1S-RMURATA_MA40H1S-R_0_0  [MURATA_MA40H1S-R_0]
U147  MURATA_MA40H1S-RMURATA_MA40H1S-R_0_0  [MURATA_MA40H1S-R_0]
U148  MURATA_MA40H1S-RMURATA_MA40H1S-R_0_0  [MURATA_MA40H1S-R_0]
U149  MURATA_MA40H1S-RMURATA_MA40H1S-R_0_0  [MURATA_MA40H1S-R_0]
U150  MURATA_MA40H1S-RMURATA_MA40H1S-R_0_0  [MURATA_MA40H1S-R_0]
U151  MURATA_MA40H1S-RMURATA_MA40H1S-R_0_0  [MURATA_MA40H1S-R_0]
U152  MURATA_MA40H1S-RMURATA_MA40H1S-R_0_0  [MURATA_MA40H1S-R_0]
U153  MURATA_MA40H1S-RMURATA_MA40H1S-R_0_0  [MURATA_MA40H1S-R_0]
U154  MURATA_MA40H1S-RMURATA_MA40H1S-R_0_0  [MURATA_MA40H1S-R_0]
U155  MURATA_MA40H1S-RMURATA_MA40H1S-R_0_0  [MURATA_MA40H1S-R_0]
U156  MURATA_MA40H1S-RMURATA_MA40H1S-R_0_0  [MURATA_MA40H1S-R_0]
U157  MURATA_MA40H1S-RMURATA_MA40H1S-R_0_0  [MURATA_MA40H1S-R_0]
U158  MURATA_MA40H1S-RMURATA_MA40H1S-R_0_0  [MURATA_MA40H1S-R_0]
U159  MURATA_MA40H1S-RMURATA_MA40H1S-R_0_0  [MURATA_MA40H1S-R_0]
U160  MURATA_MA40H1S-RMURATA_MA40H1S-R_0_0  [MURATA_MA40H1S-R_0]
U161  MURATA_MA40H1S-RMURATA_MA40H1S-R_0_0  [MURATA_MA40H1S-R_0]
U162  MURATA_MA40H1S-RMURATA_MA40H1S-R_0_0  [MURATA_MA40H1S-R_0]
U163  MURATA_MA40H1S-RMURATA_MA40H1S-R_0_0  [MURATA_MA40H1S-R_0]
U164  MURATA_MA40H1S-RMURATA_MA40H1S-R_0_0  [MURATA_MA40H1S-R_0]
U165  MURATA_MA40H1S-RMURATA_MA40H1S-R_0_0  [MURATA_MA40H1S-R_0]
U166  MURATA_MA40H1S-RMURATA_MA40H1S-R_0_0  [MURATA_MA40H1S-R_0]
U167  MURATA_MA40H1S-RMURATA_MA40H1S-R_0_0  [MURATA_MA40H1S-R_0]
U168  MURATA_MA40H1S-RMURATA_MA40H1S-R_0_0  [MURATA_MA40H1S-R_0]
U169  MURATA_MA40H1S-RMURATA_MA40H1S-R_0_0  [MURATA_MA40H1S-R_0]
U170  MURATA_MA40H1S-RMURATA_MA40H1S-R_0_0  [MURATA_MA40H1S-R_0]
U171  MURATA_MA40H1S-RMURATA_MA40H1S-R_0_0  [MURATA_MA40H1S-R_0]
U172  MURATA_MA40H1S-RMURATA_MA40H1S-R_0_0  [MURATA_MA40H1S-R_0]
U173  MURATA_MA40H1S-RMURATA_MA40H1S-R_0_0  [MURATA_MA40H1S-R_0]
U174  MURATA_MA40H1S-RMURATA_MA40H1S-R_0_0  [MURATA_MA40H1S-R_0]
U175  MURATA_MA40H1S-RMURATA_MA40H1S-R_0_0  [MURATA_MA40H1S-R_0]
U176  MURATA_MA40H1S-RMURATA_MA40H1S-R_0_0  [MURATA_MA40H1S-R_0]
U177  MURATA_MA40H1S-RMURATA_MA40H1S-R_0_0  [MURATA_MA40H1S-R_0]
U178  MURATA_MA40H1S-RMURATA_MA40H1S-R_0_0  [MURATA_MA40H1S-R_0]
U179  MURATA_MA40H1S-RMURATA_MA40H1S-R_0_0  [MURATA_MA40H1S-R_0]
U180  MURATA_MA40H1S-RMURATA_MA40H1S-R_0_0  [MURATA_MA40H1S-R_0]
U184  MURATA_MA40H1S-RMURATA_MA40H1S-R_0_0  [MURATA_MA40H1S-R_0]
U185  MURATA_MA40H1S-RMURATA_MA40H1S-R_0_0  [MURATA_MA40H1S-R_0]
U186  MURATA_MA40H1S-RMURATA_MA40H1S-R_0_0  [MURATA_MA40H1S-R_0]
U192  MURATA_MA40H1S-RMURATA_MA40H1S-R_0_0  [MURATA_MA40H1S-R_0]
U193  MURATA_MA40H1S-RMURATA_MA40H1S-R_0_0  [MURATA_MA40H1S-R_0]
U194  MURATA_MA40H1S-RMURATA_MA40H1S-R_0_0  [MURATA_MA40H1S-R_0]
U195  MURATA_MA40H1S-RMURATA_MA40H1S-R_0_0  [MURATA_MA40H1S-R_0]
U196  MURATA_MA40H1S-RMURATA_MA40H1S-R_0_0  [MURATA_MA40H1S-R_0]
U197  MURATA_MA40H1S-RMURATA_MA40H1S-R_0_0  [MURATA_MA40H1S-R_0]
U198  MURATA_MA40H1S-RMURATA_MA40H1S-R_0_0  [MURATA_MA40H1S-R_0]
U199  MURATA_MA40H1S-RMURATA_MA40H1S-R_0_0  [MURATA_MA40H1S-R_0]
U200  MURATA_MA40H1S-RMURATA_MA40H1S-R_0_0  [MURATA_MA40H1S-R_0]
U201  MURATA_MA40H1S-RMURATA_MA40H1S-R_0_0  [MURATA_MA40H1S-R_0]
U202  MURATA_MA40H1S-RMURATA_MA40H1S-R_0_0  [MURATA_MA40H1S-R_0]
U203  MURATA_MA40H1S-RMURATA_MA40H1S-R_0_0  [MURATA_MA40H1S-R_0]
U204  MURATA_MA40H1S-RMURATA_MA40H1S-R_0_0  [MURATA_MA40H1S-R_0]
U205  MURATA_MA40H1S-RMURATA_MA40H1S-R_0_0  [MURATA_MA40H1S-R_0]
U206  MURATA_MA40H1S-RMURATA_MA40H1S-R_0_0  [MURATA_MA40H1S-R_0]
U207  MURATA_MA40H1S-RMURATA_MA40H1S-R_0_0  [MURATA_MA40H1S-R_0]
U208  MURATA_MA40H1S-RMURATA_MA40H1S-R_0_0  [MURATA_MA40H1S-R_0]
U209  MURATA_MA40H1S-RMURATA_MA40H1S-R_0_0  [MURATA_MA40H1S-R_0]
U210  MURATA_MA40H1S-RMURATA_MA40H1S-R_0_0  [MURATA_MA40H1S-R_0]
U211  MURATA_MA40H1S-RMURATA_MA40H1S-R_0_0  [MURATA_MA40H1S-R_0]
U212  MURATA_MA40H1S-RMURATA_MA40H1S-R_0_0  [MURATA_MA40H1S-R_0]
U213  MURATA_MA40H1S-RMURATA_MA40H1S-R_0_0  [MURATA_MA40H1S-R_0]
U214  MURATA_MA40H1S-RMURATA_MA40H1S-R_0_0  [MURATA_MA40H1S-R_0]
U215  MURATA_MA40H1S-RMURATA_MA40H1S-R_0_0  [MURATA_MA40H1S-R_0]
U216  MURATA_MA40H1S-RMURATA_MA40H1S-R_0_0  [MURATA_MA40H1S-R_0]
U217  MURATA_MA40H1S-RMURATA_MA40H1S-R_0_0  [MURATA_MA40H1S-R_0]
U218  MURATA_MA40H1S-RMURATA_MA40H1S-R_0_0  [MURATA_MA40H1S-R_0]
U219  MURATA_MA40H1S-RMURATA_MA40H1S-R_0_0  [MURATA_MA40H1S-R_0]
U220  MURATA_MA40H1S-RMURATA_MA40H1S-R_0_0  [MURATA_MA40H1S-R_0]
U221  MURATA_MA40H1S-RMURATA_MA40H1S-R_0_0  [MURATA_MA40H1S-R_0]
U222  MURATA_MA40H1S-RMURATA_MA40H1S-R_0_0  [MURATA_MA40H1S-R_0]
U223  MURATA_MA40H1S-RMURATA_MA40H1S-R_0_0  [MURATA_MA40H1S-R_0]
U224  MURATA_MA40H1S-RMURATA_MA40H1S-R_0_0  [MURATA_MA40H1S-R_0]
U225  MURATA_MA40H1S-RMURATA_MA40H1S-R_0_0  [MURATA_MA40H1S-R_0]
U226  MURATA_MA40H1S-RMURATA_MA40H1S-R_0_0  [MURATA_MA40H1S-R_0]
U227  MURATA_MA40H1S-RMURATA_MA40H1S-R_0_0  [MURATA_MA40H1S-R_0]
U228  MURATA_MA40H1S-RMURATA_MA40H1S-R_0_0  [MURATA_MA40H1S-R_0]
U229  MURATA_MA40H1S-RMURATA_MA40H1S-R_0_0  [MURATA_MA40H1S-R_0]
U230  MURATA_MA40H1S-RMURATA_MA40H1S-R_0_0  [MURATA_MA40H1S-R_0]
U231  MURATA_MA40H1S-RMURATA_MA40H1S-R_0_0  [MURATA_MA40H1S-R_0]
U232  MURATA_MA40H1S-RMURATA_MA40H1S-R_0_0  [MURATA_MA40H1S-R_0]
U233  MURATA_MA40H1S-RMURATA_MA40H1S-R_0_0  [MURATA_MA40H1S-R_0]
U234  MURATA_MA40H1S-RMURATA_MA40H1S-R_0_0  [MURATA_MA40H1S-R_0]
U235  MURATA_MA40H1S-RMURATA_MA40H1S-R_0_0  [MURATA_MA40H1S-R_0]
U236  MURATA_MA40H1S-RMURATA_MA40H1S-R_0_0  [MURATA_MA40H1S-R_0]
U237  MURATA_MA40H1S-RMURATA_MA40H1S-R_0_0  [MURATA_MA40H1S-R_0]
U238  MURATA_MA40H1S-RMURATA_MA40H1S-R_0_0  [MURATA_MA40H1S-R_0]
U239  MURATA_MA40H1S-RMURATA_MA40H1S-R_0_0  [MURATA_MA40H1S-R_0]
U240  MURATA_MA40H1S-RMURATA_MA40H1S-R_0_0  [MURATA_MA40H1S-R_0]
U241  MURATA_MA40H1S-RMURATA_MA40H1S-R_0_0  [MURATA_MA40H1S-R_0]
U242  MURATA_MA40H1S-RMURATA_MA40H1S-R_0_0  [MURATA_MA40H1S-R_0]
U246  MURATA_MA40H1S-RMURATA_MA40H1S-R_0_0  [MURATA_MA40H1S-R_0]
U247  MURATA_MA40H1S-RMURATA_MA40H1S-R_0_0  [MURATA_MA40H1S-R_0]
U248  MURATA_MA40H1S-RMURATA_MA40H1S-R_0_0  [MURATA_MA40H1S-R_0]
U249  MURATA_MA40H1S-RMURATA_MA40H1S-R_0_0  [MURATA_MA40H1S-R_0]
U250  MURATA_MA40H1S-RMURATA_MA40H1S-R_0_0  [MURATA_MA40H1S-R_0]
U251  MURATA_MA40H1S-RMURATA_MA40H1S-R_0_0  [MURATA_MA40H1S-R_0]
U252  MURATA_MA40H1S-RMURATA_MA40H1S-R_0_0  [MURATA_MA40H1S-R_0]
U253  MURATA_MA40H1S-RMURATA_MA40H1S-R_0_0  [MURATA_MA40H1S-R_0]
U254  MURATA_MA40H1S-RMURATA_MA40H1S-R_0_0  [MURATA_MA40H1S-R_0]
U255  MURATA_MA40H1S-RMURATA_MA40H1S-R_0_0  [MURATA_MA40H1S-R_0]
U256  MURATA_MA40H1S-RMURATA_MA40H1S-R_0_0  [MURATA_MA40H1S-R_0]
U257  MURATA_MA40H1S-RMURATA_MA40H1S-R_0_0  [MURATA_MA40H1S-R_0]
U258  MURATA_MA40H1S-RMURATA_MA40H1S-R_0_0  [MURATA_MA40H1S-R_0]
U259  MURATA_MA40H1S-RMURATA_MA40H1S-R_0_0  [MURATA_MA40H1S-R_0]
U260  MURATA_MA40H1S-RMURATA_MA40H1S-R_0_0  [MURATA_MA40H1S-R_0]
U261  MURATA_MA40H1S-RMURATA_MA40H1S-R_0_0  [MURATA_MA40H1S-R_0]
U262  MURATA_MA40H1S-RMURATA_MA40H1S-R_0_0  [MURATA_MA40H1S-R_0]
U263  MURATA_MA40H1S-RMURATA_MA40H1S-R_0_0  [MURATA_MA40H1S-R_0]
U264  MURATA_MA40H1S-RMURATA_MA40H1S-R_0_0  [MURATA_MA40H1S-R_0]
U265  MURATA_MA40H1S-RMURATA_MA40H1S-R_0_0  [MURATA_MA40H1S-R_0]
U266  MURATA_MA40H1S-RMURATA_MA40H1S-R_0_0  [MURATA_MA40H1S-R_0]
U267  MURATA_MA40H1S-RMURATA_MA40H1S-R_0_0  [MURATA_MA40H1S-R_0]
U268  MURATA_MA40H1S-RMURATA_MA40H1S-R_0_0  [MURATA_MA40H1S-R_0]
U269  MURATA_MA40H1S-RMURATA_MA40H1S-R_0_0  [MURATA_MA40H1S-R_0]
U270  MURATA_MA40H1S-RMURATA_MA40H1S-R_0_0  [MURATA_MA40H1S-R_0]
U271  MURATA_MA40H1S-RMURATA_MA40H1S-R_0_0  [MURATA_MA40H1S-R_0]
U272  MURATA_MA40H1S-RMURATA_MA40H1S-R_0_0  [MURATA_MA40H1S-R_0]
U273  MURATA_MA40H1S-RMURATA_MA40H1S-R_0_0  [MURATA_MA40H1S-R_0]
U274  MURATA_MA40H1S-RMURATA_MA40H1S-R_0_0  [MURATA_MA40H1S-R_0]
U275  MURATA_MA40H1S-RMURATA_MA40H1S-R_0_0  [MURATA_MA40H1S-R_0]

## Nets
GND: U1.3(2_SIGNAL_TERMINAL) U2.3(2_SIGNAL_TERMINAL) U3.3(2_SIGNAL_TERMINAL) U4.3(2_SIGNAL_TERMINAL) U6.3(2_SIGNAL_TERMINAL) U9.3(2_SIGNAL_TERMINAL) U10.3(2_SIGNAL_TERMINAL) U12.3(2_SIGNAL_TERMINAL) U13.3(2_SIGNAL_TERMINAL) U14.3(2_SIGNAL_TERMINAL) U15.3(2_SIGNAL_TERMINAL) U16.3(2_SIGNAL_TERMINAL) U21.3(2_SIGNAL_TERMINAL) U22.3(2_SIGNAL_TERMINAL) U23.3(2_SIGNAL_TERMINAL) U24.3(2_SIGNAL_TERMINAL) U25.3(2_SIGNAL_TERMINAL) U26.3(2_SIGNAL_TERMINAL) U27.3(2_SIGNAL_TERMINAL) U28.3(2_SIGNAL_TERMINAL) U29.3(2_SIGNAL_TERMINAL) U30.3(2_SIGNAL_TERMINAL) U31.3(2_SIGNAL_TERMINAL) U32.3(2_SIGNAL_TERMINAL) U33.3(2_SIGNAL_TERMINAL) U34.3(2_SIGNAL_TERMINAL) U35.3(2_SIGNAL_TERMINAL) U36.3(2_SIGNAL_TERMINAL) U37.3(2_SIGNAL_TERMINAL) U38.3(2_SIGNAL_TERMINAL) U39.3(2_SIGNAL_TERMINAL) U40.3(2_SIGNAL_TERMINAL) U41.3(2_SIGNAL_TERMINAL) U42.3(2_SIGNAL_TERMINAL) U43.3(2_SIGNAL_TERMINAL) U44.3(2_SIGNAL_TERMINAL) U45.3(2_SIGNAL_TERMINAL) U46.3(2_SIGNAL_TERMINAL) U47.3(2_SIGNAL_TERMINAL) U48.3(2_SIGNAL_TERMINAL) U49.3(2_SIGNAL_TERMINAL) U50.3(2_SIGNAL_TERMINAL) U51.3(2_SIGNAL_TERMINAL) U52.3(2_SIGNAL_TERMINAL) U53.3(2_SIGNAL_TERMINAL) U54.3(2_SIGNAL_TERMINAL) U55.3(2_SIGNAL_TERMINAL) U56.3(2_SIGNAL_TERMINAL) U57.3(2_SIGNAL_TERMINAL) U58.3(2_SIGNAL_TERMINAL) U59.3(2_SIGNAL_TERMINAL) U60.3(2_SIGNAL_TERMINAL) U61.3(2_SIGNAL_TERMINAL) U62.3(2_SIGNAL_TERMINAL) U63.3(2_SIGNAL_TERMINAL) U64.3(2_SIGNAL_TERMINAL) U65.3(2_SIGNAL_TERMINAL) U66.3(2_SIGNAL_TERMINAL) U67.3(2_SIGNAL_TERMINAL) U68.3(2_SIGNAL_TERMINAL) U69.3(2_SIGNAL_TERMINAL) U70.3(2_SIGNAL_TERMINAL) U71.3(2_SIGNAL_TERMINAL) U72.3(2_SIGNAL_TERMINAL) U73.3(2_SIGNAL_TERMINAL) U74.3(2_SIGNAL_TERMINAL) U75.3(2_SIGNAL_TERMINAL) U76.3(2_SIGNAL_TERMINAL) U77.3(2_SIGNAL_TERMINAL) U78.3(2_SIGNAL_TERMINAL) U79.3(2_SIGNAL_TERMINAL) U80.3(2_SIGNAL_TERMINAL) U90.3(2_SIGNAL_TERMINAL) U91.3(2_SIGNAL_TERMINAL) U92.3(2_SIGNAL_TERMINAL) U93.3(2_SIGNAL_TERMINAL) U94.3(2_SIGNAL_TERMINAL) U95.3(2_SIGNAL_TERMINAL) U96.3(2_SIGNAL_TERMINAL) U97.3(2_SIGNAL_TERMINAL) U98.3(2_SIGNAL_TERMINAL) U99.3(2_SIGNAL_TERMINAL) U100.3(2_SIGNAL_TERMINAL) U101.3(2_SIGNAL_TERMINAL) U102.3(2_SIGNAL_TERMINAL) U103.3(2_SIGNAL_TERMINAL) U104.3(2_SIGNAL_TERMINAL) U105.3(2_SIGNAL_TERMINAL) U106.3(2_SIGNAL_TERMINAL) U107.3(2_SIGNAL_TERMINAL) U108.3(2_SIGNAL_TERMINAL) U109.3(2_SIGNAL_TERMINAL) U110.3(2_SIGNAL_TERMINAL) U111.3(2_SIGNAL_TERMINAL) U112.3(2_SIGNAL_TERMINAL) U113.3(2_SIGNAL_TERMINAL) U114.3(2_SIGNAL_TERMINAL) U115.3(2_SIGNAL_TERMINAL) U116.3(2_SIGNAL_TERMINAL) U117.3(2_SIGNAL_TERMINAL) U118.3(2_SIGNAL_TERMINAL) U119.3(2_SIGNAL_TERMINAL) U120.3(2_SIGNAL_TERMINAL) U121.3(2_SIGNAL_TERMINAL) U122.3(2_SIGNAL_TERMINAL) U123.3(2_SIGNAL_TERMINAL) U124.3(2_SIGNAL_TERMINAL) U125.3(2_SIGNAL_TERMINAL) U126.3(2_SIGNAL_TERMINAL) U127.3(2_SIGNAL_TERMINAL) U128.3(2_SIGNAL_TERMINAL) U129.3(2_SIGNAL_TERMINAL) U130.3(2_SIGNAL_TERMINAL) U131.3(2_SIGNAL_TERMINAL) U132.3(2_SIGNAL_TERMINAL) U133.3(2_SIGNAL_TERMINAL) U134.3(2_SIGNAL_TERMINAL) U135.3(2_SIGNAL_TERMINAL) U136.3(2_SIGNAL_TERMINAL) U137.3(2_SIGNAL_TERMINAL) U138.3(2_SIGNAL_TERMINAL) U139.3(2_SIGNAL_TERMINAL) U140.3(2_SIGNAL_TERMINAL) U141.3(2_SIGNAL_TERMINAL) U142.3(2_SIGNAL_TERMINAL) U143.3(2_SIGNAL_TERMINAL) U144.3(2_SIGNAL_TERMINAL) U145.3(2_SIGNAL_TERMINAL) U146.3(2_SIGNAL_TERMINAL) U147.3(2_SIGNAL_TERMINAL) U148.3(2_SIGNAL_TERMINAL) U149.3(2_SIGNAL_TERMINAL) U150.3(2_SIGNAL_TERMINAL) U151.3(2_SIGNAL_TERMINAL) U152.3(2_SIGNAL_TERMINAL) U153.3(2_SIGNAL_TERMINAL) U154.3(2_SIGNAL_TERMINAL) U155.3(2_SIGNAL_TERMINAL) U156.3(2_SIGNAL_TERMINAL) U157.3(2_SIGNAL_TERMINAL) U158.3(2_SIGNAL_TERMINAL) U159.3(2_SIGNAL_TERMINAL) U160.3(2_SIGNAL_TERMINAL) U161.3(2_SIGNAL_TERMINAL) U162.3(2_SIGNAL_TERMINAL) U163.3(2_SIGNAL_TERMINAL) U164.3(2_SIGNAL_TERMINAL) U165.3(2_SIGNAL_TERMINAL) U166.3(2_SIGNAL_TERMINAL) U167.3(2_SIGNAL_TERMINAL) U168.3(2_SIGNAL_TERMINAL) U169.3(2_SIGNAL_TERMINAL) U170.3(2_SIGNAL_TERMINAL) U171.3(2_SIGNAL_TERMINAL) U172.3(2_SIGNAL_TERMINAL) U173.3(2_SIGNAL_TERMINAL) U174.3(2_SIGNAL_TERMINAL) U175.3(2_SIGNAL_TERMINAL) U176.3(2_SIGNAL_TERMINAL) U177.3(2_SIGNAL_TERMINAL) U178.3(2_SIGNAL_TERMINAL) U179.3(2_SIGNAL_TERMINAL) U180.3(2_SIGNAL_TERMINAL) U184.3(2_SIGNAL_TERMINAL) U185.3(2_SIGNAL_TERMINAL) U186.3(2_SIGNAL_TERMINAL) U192.3(2_SIGNAL_TERMINAL) U193.3(2_SIGNAL_TERMINAL) U194.3(2_SIGNAL_TERMINAL) U195.3(2_SIGNAL_TERMINAL) U196.3(2_SIGNAL_TERMINAL) U197.3(2_SIGNAL_TERMINAL) U198.3(2_SIGNAL_TERMINAL) U199.3(2_SIGNAL_TERMINAL) U200.3(2_SIGNAL_TERMINAL) U201.3(2_SIGNAL_TERMINAL) U202.3(2_SIGNAL_TERMINAL) U203.3(2_SIGNAL_TERMINAL) U204.3(2_SIGNAL_TERMINAL) U205.3(2_SIGNAL_TERMINAL) U206.3(2_SIGNAL_TERMINAL) U207.3(2_SIGNAL_TERMINAL) U208.3(2_SIGNAL_TERMINAL) U209.3(2_SIGNAL_TERMINAL) U210.3(2_SIGNAL_TERMINAL) U211.3(2_SIGNAL_TERMINAL) U212.3(2_SIGNAL_TERMINAL) U213.3(2_SIGNAL_TERMINAL) U214.3(2_SIGNAL_TERMINAL) U215.3(2_SIGNAL_TERMINAL) U216.3(2_SIGNAL_TERMINAL) U217.3(2_SIGNAL_TERMINAL) U218.3(2_SIGNAL_TERMINAL) U219.3(2_SIGNAL_TERMINAL) U220.3(2_SIGNAL_TERMINAL) U221.3(2_SIGNAL_TERMINAL) U222.3(2_SIGNAL_TERMINAL) U223.3(2_SIGNAL_TERMINAL) U224.3(2_SIGNAL_TERMINAL) U225.3(2_SIGNAL_TERMINAL) U226.3(2_SIGNAL_TERMINAL) U227.3(2_SIGNAL_TERMINAL) U228.3(2_SIGNAL_TERMINAL) U229.3(2_SIGNAL_TERMINAL) U230.3(2_SIGNAL_TERMINAL) U231.3(2_SIGNAL_TERMINAL) U232.3(2_SIGNAL_TERMINAL) U233.3(2_SIGNAL_TERMINAL) U234.3(2_SIGNAL_TERMINAL) U235.3(2_SIGNAL_TERMINAL) U236.3(2_SIGNAL_TERMINAL) U237.3(2_SIGNAL_TERMINAL) U238.3(2_SIGNAL_TERMINAL) U239.3(2_SIGNAL_TERMINAL) U240.3(2_SIGNAL_TERMINAL) U241.3(2_SIGNAL_TERMINAL) U242.3(2_SIGNAL_TERMINAL) U246.3(2_SIGNAL_TERMINAL) U247.3(2_SIGNAL_TERMINAL) U248.3(2_SIGNAL_TERMINAL) U249.3(2_SIGNAL_TERMINAL) U250.3(2_SIGNAL_TERMINAL) U251.3(2_SIGNAL_TERMINAL) U252.3(2_SIGNAL_TERMINAL) U253.3(2_SIGNAL_TERMINAL) U254.3(2_SIGNAL_TERMINAL) U255.3(2_SIGNAL_TERMINAL) U256.3(2_SIGNAL_TERMINAL) U257.3(2_SIGNAL_TERMINAL) U258.3(2_SIGNAL_TERMINAL) U259.3(2_SIGNAL_TERMINAL) U260.3(2_SIGNAL_TERMINAL) U261.3(2_SIGNAL_TERMINAL) U262.3(2_SIGNAL_TERMINAL) U263.3(2_SIGNAL_TERMINAL) U264.3(2_SIGNAL_TERMINAL) U265.3(2_SIGNAL_TERMINAL) U266.3(2_SIGNAL_TERMINAL) U267.3(2_SIGNAL_TERMINAL) U268.3(2_SIGNAL_TERMINAL) U269.3(2_SIGNAL_TERMINAL) U270.3(2_SIGNAL_TERMINAL) U271.3(2_SIGNAL_TERMINAL) U272.3(2_SIGNAL_TERMINAL) U273.3(2_SIGNAL_TERMINAL) U274.3(2_SIGNAL_TERMINAL) U275.3(2_SIGNAL_TERMINAL)
N$1: J7.2 U1.1(1_SIGNAL_TERMINAL) U2.1(1_SIGNAL_TERMINAL) U3.1(1_SIGNAL_TERMINAL) U4.1(1_SIGNAL_TERMINAL)
N$3: J5.14 U6.1(1_SIGNAL_TERMINAL) U9.1(1_SIGNAL_TERMINAL) U10.1(1_SIGNAL_TERMINAL)
N$5: J6.2 U14.1(1_SIGNAL_TERMINAL) U15.1(1_SIGNAL_TERMINAL) U16.1(1_SIGNAL_TERMINAL)
N$6: J7.4 U21.1(1_SIGNAL_TERMINAL) U22.1(1_SIGNAL_TERMINAL) U23.1(1_SIGNAL_TERMINAL) U24.1(1_SIGNAL_TERMINAL)
N$7: J4.12 U25.1(1_SIGNAL_TERMINAL) U26.1(1_SIGNAL_TERMINAL) U27.1(1_SIGNAL_TERMINAL) U28.1(1_SIGNAL_TERMINAL)
N$8: J4.16 U29.1(1_SIGNAL_TERMINAL) U30.1(1_SIGNAL_TERMINAL) U31.1(1_SIGNAL_TERMINAL) U32.1(1_SIGNAL_TERMINAL)
N$9: J4.2 U33.1(1_SIGNAL_TERMINAL) U34.1(1_SIGNAL_TERMINAL) U35.1(1_SIGNAL_TERMINAL) U36.1(1_SIGNAL_TERMINAL)
N$10: J4.10 U41.1(1_SIGNAL_TERMINAL) U42.1(1_SIGNAL_TERMINAL) U43.1(1_SIGNAL_TERMINAL) U44.1(1_SIGNAL_TERMINAL)
N$11: J4.4 U37.1(1_SIGNAL_TERMINAL) U38.1(1_SIGNAL_TERMINAL) U39.1(1_SIGNAL_TERMINAL) U40.1(1_SIGNAL_TERMINAL)
N$12: J4.14 U45.1(1_SIGNAL_TERMINAL) U46.1(1_SIGNAL_TERMINAL) U47.1(1_SIGNAL_TERMINAL) U48.1(1_SIGNAL_TERMINAL)
N$13: J5.16 U49.1(1_SIGNAL_TERMINAL) U50.1(1_SIGNAL_TERMINAL) U51.1(1_SIGNAL_TERMINAL) U52.1(1_SIGNAL_TERMINAL)
N$14: J8.2 U53.1(1_SIGNAL_TERMINAL) U54.1(1_SIGNAL_TERMINAL) U55.1(1_SIGNAL_TERMINAL) U56.1(1_SIGNAL_TERMINAL)
N$15: J7.16 U57.1(1_SIGNAL_TERMINAL) U58.1(1_SIGNAL_TERMINAL) U59.1(1_SIGNAL_TERMINAL) U60.1(1_SIGNAL_TERMINAL)
N$16: J7.14 U61.1(1_SIGNAL_TERMINAL) U62.1(1_SIGNAL_TERMINAL) U63.1(1_SIGNAL_TERMINAL) U64.1(1_SIGNAL_TERMINAL)
N$18: J7.10 U69.1(1_SIGNAL_TERMINAL) U70.1(1_SIGNAL_TERMINAL) U71.1(1_SIGNAL_TERMINAL) U72.1(1_SIGNAL_TERMINAL)
N$19: J6.10 U11.1(1_SIGNAL_TERMINAL) U12.1(1_SIGNAL_TERMINAL) U13.1(1_SIGNAL_TERMINAL)
N$20: J7.6 U77.1(1_SIGNAL_TERMINAL) U78.1(1_SIGNAL_TERMINAL) U79.1(1_SIGNAL_TERMINAL) U80.1(1_SIGNAL_TERMINAL)
N$24: J5.12 U92.1(1_SIGNAL_TERMINAL) U93.1(1_SIGNAL_TERMINAL) U94.1(1_SIGNAL_TERMINAL) U95.1(1_SIGNAL_TERMINAL)
N$25: J8.4 U96.1(1_SIGNAL_TERMINAL) U97.1(1_SIGNAL_TERMINAL) U98.1(1_SIGNAL_TERMINAL) U99.1(1_SIGNAL_TERMINAL)
N$26: J8.14 U100.1(1_SIGNAL_TERMINAL) U101.1(1_SIGNAL_TERMINAL) U102.1(1_SIGNAL_TERMINAL) U103.1(1_SIGNAL_TERMINAL)
N$27: J8.16 U104.1(1_SIGNAL_TERMINAL) U105.1(1_SIGNAL_TERMINAL) U106.1(1_SIGNAL_TERMINAL) U107.1(1_SIGNAL_TERMINAL)
N$28: J5.6 U108.1(1_SIGNAL_TERMINAL) U109.1(1_SIGNAL_TERMINAL) U110.1(1_SIGNAL_TERMINAL) U111.1(1_SIGNAL_TERMINAL)
N$29: J6.14 U112.1(1_SIGNAL_TERMINAL) U113.1(1_SIGNAL_TERMINAL) U114.1(1_SIGNAL_TERMINAL) U115.1(1_SIGNAL_TERMINAL)
N$30: J4.8 U90.1(1_SIGNAL_TERMINAL) U91.1(1_SIGNAL_TERMINAL) U116.1(1_SIGNAL_TERMINAL) U117.1(1_SIGNAL_TERMINAL)
N$31: J5.4 U119.1(1_SIGNAL_TERMINAL) U120.1(1_SIGNAL_TERMINAL) U121.1(1_SIGNAL_TERMINAL) U122.1(1_SIGNAL_TERMINAL)
N$32: J5.10 U123.1(1_SIGNAL_TERMINAL) U124.1(1_SIGNAL_TERMINAL) U125.1(1_SIGNAL_TERMINAL) U126.1(1_SIGNAL_TERMINAL)
N$33: J8.6 U127.1(1_SIGNAL_TERMINAL) U128.1(1_SIGNAL_TERMINAL) U129.1(1_SIGNAL_TERMINAL) U130.1(1_SIGNAL_TERMINAL)
N$34: J8.12 U131.1(1_SIGNAL_TERMINAL) U132.1(1_SIGNAL_TERMINAL) U133.1(1_SIGNAL_TERMINAL) U134.1(1_SIGNAL_TERMINAL)
N$35: J6.16 U135.1(1_SIGNAL_TERMINAL) U136.1(1_SIGNAL_TERMINAL) U137.1(1_SIGNAL_TERMINAL) U138.1(1_SIGNAL_TERMINAL)
N$36: J6.8 U139.1(1_SIGNAL_TERMINAL) U140.1(1_SIGNAL_TERMINAL) U141.1(1_SIGNAL_TERMINAL) U142.1(1_SIGNAL_TERMINAL)
N$37: J5.2 U143.1(1_SIGNAL_TERMINAL) U144.1(1_SIGNAL_TERMINAL) U145.1(1_SIGNAL_TERMINAL) U149.1(1_SIGNAL_TERMINAL)
N$38: J6.4 U146.1(1_SIGNAL_TERMINAL) U147.1(1_SIGNAL_TERMINAL) U148.1(1_SIGNAL_TERMINAL)
N$39: J5.8 U150.1(1_SIGNAL_TERMINAL) U151.1(1_SIGNAL_TERMINAL) U152.1(1_SIGNAL_TERMINAL) U153.1(1_SIGNAL_TERMINAL)
N$40: J8.8 U154.1(1_SIGNAL_TERMINAL) U155.1(1_SIGNAL_TERMINAL) U156.1(1_SIGNAL_TERMINAL) U157.1(1_SIGNAL_TERMINAL)
N$41: J8.10 U158.1(1_SIGNAL_TERMINAL) U159.1(1_SIGNAL_TERMINAL) U160.1(1_SIGNAL_TERMINAL) U161.1(1_SIGNAL_TERMINAL)
N$42: J6.12 U162.1(1_SIGNAL_TERMINAL) U163.1(1_SIGNAL_TERMINAL) U164.1(1_SIGNAL_TERMINAL) U165.1(1_SIGNAL_TERMINAL)
N$43: J6.6 U166.1(1_SIGNAL_TERMINAL) U167.1(1_SIGNAL_TERMINAL) U168.1(1_SIGNAL_TERMINAL) U169.1(1_SIGNAL_TERMINAL)
N$44: J3.4 U118.1(1_SIGNAL_TERMINAL) U170.1(1_SIGNAL_TERMINAL) U171.1(1_SIGNAL_TERMINAL) U172.1(1_SIGNAL_TERMINAL)
N$45: J3.6 U173.1(1_SIGNAL_TERMINAL) U174.1(1_SIGNAL_TERMINAL) U175.1(1_SIGNAL_TERMINAL) U176.1(1_SIGNAL_TERMINAL)
N$46: J3.10 U177.1(1_SIGNAL_TERMINAL) U178.1(1_SIGNAL_TERMINAL) U179.1(1_SIGNAL_TERMINAL) U180.1(1_SIGNAL_TERMINAL)
N$47: J7.8 U73.1(1_SIGNAL_TERMINAL) U74.1(1_SIGNAL_TERMINAL) U75.1(1_SIGNAL_TERMINAL) U76.1(1_SIGNAL_TERMINAL)
N$48: J4.6 U184.1(1_SIGNAL_TERMINAL) U185.1(1_SIGNAL_TERMINAL) U186.1(1_SIGNAL_TERMINAL)
N$50: J2.8 U192.1(1_SIGNAL_TERMINAL) U193.1(1_SIGNAL_TERMINAL) U194.1(1_SIGNAL_TERMINAL) U195.1(1_SIGNAL_TERMINAL)
N$51: J2.14 U196.1(1_SIGNAL_TERMINAL) U197.1(1_SIGNAL_TERMINAL) U198.1(1_SIGNAL_TERMINAL) U199.1(1_SIGNAL_TERMINAL)
N$52: J3.8 U200.1(1_SIGNAL_TERMINAL) U201.1(1_SIGNAL_TERMINAL) U202.1(1_SIGNAL_TERMINAL) U203.1(1_SIGNAL_TERMINAL)
N$53: J3.12 U204.1(1_SIGNAL_TERMINAL) U205.1(1_SIGNAL_TERMINAL) U206.1(1_SIGNAL_TERMINAL) U207.1(1_SIGNAL_TERMINAL)
N$54: J1.14 U208.1(1_SIGNAL_TERMINAL) U209.1(1_SIGNAL_TERMINAL) U210.1(1_SIGNAL_TERMINAL) U211.1(1_SIGNAL_TERMINAL)
N$55: J1.8 U212.1(1_SIGNAL_TERMINAL) U213.1(1_SIGNAL_TERMINAL) U214.1(1_SIGNAL_TERMINAL) U215.1(1_SIGNAL_TERMINAL)
N$56: J2.4 U216.1(1_SIGNAL_TERMINAL) U217.1(1_SIGNAL_TERMINAL) U218.1(1_SIGNAL_TERMINAL) U222.1(1_SIGNAL_TERMINAL)
N$57: J1.6 U219.1(1_SIGNAL_TERMINAL) U220.1(1_SIGNAL_TERMINAL) U221.1(1_SIGNAL_TERMINAL)
N$58: J2.12 U223.1(1_SIGNAL_TERMINAL) U224.1(1_SIGNAL_TERMINAL) U225.1(1_SIGNAL_TERMINAL) U226.1(1_SIGNAL_TERMINAL)
N$59: J3.2 U227.1(1_SIGNAL_TERMINAL) U228.1(1_SIGNAL_TERMINAL) U229.1(1_SIGNAL_TERMINAL) U230.1(1_SIGNAL_TERMINAL)
N$60: J3.16 U231.1(1_SIGNAL_TERMINAL) U232.1(1_SIGNAL_TERMINAL) U233.1(1_SIGNAL_TERMINAL) U234.1(1_SIGNAL_TERMINAL)
N$61: J2.2 U235.1(1_SIGNAL_TERMINAL) U236.1(1_SIGNAL_TERMINAL) U237.1(1_SIGNAL_TERMINAL) U238.1(1_SIGNAL_TERMINAL)
N$62: J1.12 U239.1(1_SIGNAL_TERMINAL) U240.1(1_SIGNAL_TERMINAL) U241.1(1_SIGNAL_TERMINAL) U242.1(1_SIGNAL_TERMINAL)
N$64: J2.6 U246.1(1_SIGNAL_TERMINAL) U247.1(1_SIGNAL_TERMINAL) U248.1(1_SIGNAL_TERMINAL) U249.1(1_SIGNAL_TERMINAL)
N$65: J2.10 U250.1(1_SIGNAL_TERMINAL) U251.1(1_SIGNAL_TERMINAL) U252.1(1_SIGNAL_TERMINAL) U253.1(1_SIGNAL_TERMINAL)
N$66: J2.16 U254.1(1_SIGNAL_TERMINAL) U255.1(1_SIGNAL_TERMINAL) U256.1(1_SIGNAL_TERMINAL) U257.1(1_SIGNAL_TERMINAL)
N$67: J3.14 U258.1(1_SIGNAL_TERMINAL) U259.1(1_SIGNAL_TERMINAL) U260.1(1_SIGNAL_TERMINAL) U261.1(1_SIGNAL_TERMINAL)
N$68: J1.16 U262.1(1_SIGNAL_TERMINAL) U263.1(1_SIGNAL_TERMINAL) U264.1(1_SIGNAL_TERMINAL) U265.1(1_SIGNAL_TERMINAL)
N$69: J1.10 U266.1(1_SIGNAL_TERMINAL) U267.1(1_SIGNAL_TERMINAL) U268.1(1_SIGNAL_TERMINAL) U269.1(1_SIGNAL_TERMINAL)
N$70: J1.2 U270.1(1_SIGNAL_TERMINAL) U271.1(1_SIGNAL_TERMINAL) U272.1(1_SIGNAL_TERMINAL)
N$71: J1.4 U273.1(1_SIGNAL_TERMINAL) U274.1(1_SIGNAL_TERMINAL) U275.1(1_SIGNAL_TERMINAL)
N$74: J7.12 U65.1(1_SIGNAL_TERMINAL) U66.1(1_SIGNAL_TERMINAL) U67.1(1_SIGNAL_TERMINAL) U68.1(1_SIGNAL_TERMINAL)
Unconnected: J1.1 J1.3 J1.5 J1.7 J1.9 J1.11 J1.13 J1.15 J2.1 J2.3 J2.5 J2.7 J2.9 J2.11 J2.13 J2.15 J3.1 J3.3 J3.5 J3.7 J3.9 J3.11 J3.13 J3.15 J4.1 J4.3 J4.5 J4.7 J4.9 J4.11 J4.13 J4.15 J5.1 J5.3 J5.5 J5.7 J5.9 J5.11 J5.13 J5.15 J6.1 J6.3 J6.5 J6.7 J6.9 J6.11 J6.13 J6.15 J7.1 J7.3 J7.5 J7.7 J7.9 J7.11 J7.13 J7.15 J8.1 J8.3 J8.5 J8.7 J8.9 J8.11 J8.13 J8.15 U1.2(1_NC) U1.4(2_NC) U2.2(1_NC) U2.4(2_NC) U3.2(1_NC) U3.4(2_NC) U4.2(1_NC) U4.4(2_NC) U6.2(1_NC) U6.4(2_NC) U9.2(1_NC) U9.4(2_NC) U10.2(1_NC) U10.4(2_NC) U11.2(1_NC) U11.3(2_SIGNAL_TERMINAL) U11.4(2_NC) U12.2(1_NC) U12.4(2_NC) U13.2(1_NC) U13.4(2_NC) U14.2(1_NC) U14.4(2_NC) U15.2(1_NC) U15.4(2_NC) U16.2(1_NC) U16.4(2_NC) U21.2(1_NC) U21.4(2_NC) U22.2(1_NC) U22.4(2_NC) U23.2(1_NC) U23.4(2_NC) U24.2(1_NC) U24.4(2_NC) U25.2(1_NC) U25.4(2_NC) U26.2(1_NC) U26.4(2_NC) U27.2(1_NC) U27.4(2_NC) U28.2(1_NC) U28.4(2_NC) U29.2(1_NC) U29.4(2_NC) U30.2(1_NC) U30.4(2_NC) U31.2(1_NC) U31.4(2_NC) U32.2(1_NC) U32.4(2_NC) U33.2(1_NC) U33.4(2_NC) U34.2(1_NC) U34.4(2_NC) U35.2(1_NC) U35.4(2_NC) U36.2(1_NC) U36.4(2_NC) U37.2(1_NC) U37.4(2_NC) U38.2(1_NC) U38.4(2_NC) U39.2(1_NC) U39.4(2_NC) U40.2(1_NC) U40.4(2_NC) U41.2(1_NC) U41.4(2_NC) U42.2(1_NC) U42.4(2_NC) U43.2(1_NC) U43.4(2_NC) U44.2(1_NC) U44.4(2_NC) U45.2(1_NC) U45.4(2_NC) U46.2(1_NC) U46.4(2_NC) U47.2(1_NC) U47.4(2_NC) U48.2(1_NC) U48.4(2_NC) U49.2(1_NC) U49.4(2_NC) U50.2(1_NC) U50.4(2_NC) U51.2(1_NC) U51.4(2_NC) U52.2(1_NC) U52.4(2_NC) U53.2(1_NC) U53.4(2_NC) U54.2(1_NC) U54.4(2_NC) U55.2(1_NC) U55.4(2_NC) U56.2(1_NC) U56.4(2_NC) U57.2(1_NC) U57.4(2_NC) U58.2(1_NC) U58.4(2_NC) U59.2(1_NC) U59.4(2_NC) U60.2(1_NC) U60.4(2_NC) U61.2(1_NC) U61.4(2_NC) U62.2(1_NC) U62.4(2_NC) U63.2(1_NC) U63.4(2_NC) U64.2(1_NC) U64.4(2_NC) U65.2(1_NC) U65.4(2_NC) U66.2(1_NC) U66.4(2_NC) U67.2(1_NC) U67.4(2_NC) U68.2(1_NC) U68.4(2_NC) U69.2(1_NC) U69.4(2_NC) U70.2(1_NC) U70.4(2_NC) U71.2(1_NC) U71.4(2_NC) U72.2(1_NC) U72.4(2_NC) U73.2(1_NC) U73.4(2_NC) U74.2(1_NC) U74.4(2_NC) U75.2(1_NC) U75.4(2_NC) U76.2(1_NC) U76.4(2_NC) U77.2(1_NC) U77.4(2_NC) U78.2(1_NC) U78.4(2_NC) U79.2(1_NC) U79.4(2_NC) U80.2(1_NC) U80.4(2_NC) U90.2(1_NC) U90.4(2_NC) U91.2(1_NC) U91.4(2_NC) U92.2(1_NC) U92.4(2_NC) U93.2(1_NC) U93.4(2_NC) U94.2(1_NC) U94.4(2_NC) U95.2(1_NC) U95.4(2_NC) U96.2(1_NC) U96.4(2_NC) U97.2(1_NC) U97.4(2_NC) U98.2(1_NC) U98.4(2_NC) U99.2(1_NC) U99.4(2_NC) U100.2(1_NC) U100.4(2_NC) U101.2(1_NC) U101.4(2_NC) U102.2(1_NC) U102.4(2_NC) U103.2(1_NC) U103.4(2_NC) U104.2(1_NC) U104.4(2_NC) U105.2(1_NC) U105.4(2_NC) U106.2(1_NC) U106.4(2_NC) U107.2(1_NC) U107.4(2_NC) U108.2(1_NC) U108.4(2_NC) U109.2(1_NC) U109.4(2_NC) U110.2(1_NC) U110.4(2_NC) U111.2(1_NC) U111.4(2_NC) U112.2(1_NC) U112.4(2_NC) U113.2(1_NC) U113.4(2_NC) U114.2(1_NC) U114.4(2_NC) U115.2(1_NC) U115.4(2_NC) U116.2(1_NC) U116.4(2_NC) U117.2(1_NC) U117.4(2_NC) U118.2(1_NC) U118.4(2_NC) U119.2(1_NC) U119.4(2_NC) U120.2(1_NC) U120.4(2_NC) U121.2(1_NC) U121.4(2_NC) U122.2(1_NC) U122.4(2_NC) U123.2(1_NC) U123.4(2_NC) U124.2(1_NC) U124.4(2_NC) U125.2(1_NC) U125.4(2_NC) U126.2(1_NC) U126.4(2_NC) U127.2(1_NC) U127.4(2_NC) U128.2(1_NC) U128.4(2_NC) U129.2(1_NC) U129.4(2_NC) U130.2(1_NC) U130.4(2_NC) U131.2(1_NC) U131.4(2_NC) U132.2(1_NC) U132.4(2_NC) U133.2(1_NC) U133.4(2_NC) U134.2(1_NC) U134.4(2_NC) U135.2(1_NC) U135.4(2_NC) U136.2(1_NC) U136.4(2_NC) U137.2(1_NC) U137.4(2_NC) U138.2(1_NC) U138.4(2_NC) U139.2(1_NC) U139.4(2_NC) U140.2(1_NC) U140.4(2_NC) U141.2(1_NC) U141.4(2_NC) U142.2(1_NC) U142.4(2_NC) U143.2(1_NC) U143.4(2_NC) U144.2(1_NC) U144.4(2_NC) U145.2(1_NC) U145.4(2_NC) U146.2(1_NC) U146.4(2_NC) U147.2(1_NC) U147.4(2_NC) U148.2(1_NC) U148.4(2_NC) U149.2(1_NC) U149.4(2_NC) U150.2(1_NC) U150.4(2_NC) U151.2(1_NC) U151.4(2_NC) U152.2(1_NC) U152.4(2_NC) U153.2(1_NC) U153.4(2_NC) U154.2(1_NC) U154.4(2_NC) U155.2(1_NC) U155.4(2_NC) U156.2(1_NC) U156.4(2_NC) U157.2(1_NC) U157.4(2_NC) U158.2(1_NC) U158.4(2_NC) U159.2(1_NC) U159.4(2_NC) U160.2(1_NC) U160.4(2_NC) U161.2(1_NC) U161.4(2_NC) U162.2(1_NC) U162.4(2_NC) U163.2(1_NC) U163.4(2_NC) U164.2(1_NC) U164.4(2_NC) U165.2(1_NC) U165.4(2_NC) U166.2(1_NC) U166.4(2_NC) U167.2(1_NC) U167.4(2_NC) U168.2(1_NC) U168.4(2_NC) U169.2(1_NC) U169.4(2_NC) U170.2(1_NC) U170.4(2_NC) U171.2(1_NC) U171.4(2_NC) U172.2(1_NC) U172.4(2_NC) U173.2(1_NC) U173.4(2_NC) U174.2(1_NC) U174.4(2_NC) U175.2(1_NC) U175.4(2_NC) U176.2(1_NC) U176.4(2_NC) U177.2(1_NC) U177.4(2_NC) U178.2(1_NC) U178.4(2_NC) U179.2(1_NC) U179.4(2_NC) U180.2(1_NC) U180.4(2_NC) U184.2(1_NC) U184.4(2_NC) U185.2(1_NC) U185.4(2_NC) U186.2(1_NC) U186.4(2_NC) U192.2(1_NC) U192.4(2_NC) U193.2(1_NC) U193.4(2_NC) U194.2(1_NC) U194.4(2_NC) U195.2(1_NC) U195.4(2_NC) U196.2(1_NC) U196.4(2_NC) U197.2(1_NC) U197.4(2_NC) U198.2(1_NC) U198.4(2_NC) U199.2(1_NC) U199.4(2_NC) U200.2(1_NC) U200.4(2_NC) U201.2(1_NC) U201.4(2_NC) U202.2(1_NC) U202.4(2_NC) U203.2(1_NC) U203.4(2_NC) U204.2(1_NC) U204.4(2_NC) U205.2(1_NC) U205.4(2_NC) U206.2(1_NC) U206.4(2_NC) U207.2(1_NC) U207.4(2_NC) U208.2(1_NC) U208.4(2_NC) U209.2(1_NC) U209.4(2_NC) U210.2(1_NC) U210.4(2_NC) U211.2(1_NC) U211.4(2_NC) U212.2(1_NC) U212.4(2_NC) U213.2(1_NC) U213.4(2_NC) U214.2(1_NC) U214.4(2_NC) U215.2(1_NC) U215.4(2_NC) U216.2(1_NC) U216.4(2_NC) U217.2(1_NC) U217.4(2_NC) U218.2(1_NC) U218.4(2_NC) U219.2(1_NC) U219.4(2_NC) U220.2(1_NC) U220.4(2_NC) U221.2(1_NC) U221.4(2_NC) U222.2(1_NC) U222.4(2_NC) U223.2(1_NC) U223.4(2_NC) U224.2(1_NC) U224.4(2_NC) U225.2(1_NC) U225.4(2_NC) U226.2(1_NC) U226.4(2_NC) U227.2(1_NC) U227.4(2_NC) U228.2(1_NC) U228.4(2_NC) U229.2(1_NC) U229.4(2_NC) U230.2(1_NC) U230.4(2_NC) U231.2(1_NC) U231.4(2_NC) U232.2(1_NC) U232.4(2_NC) U233.2(1_NC) U233.4(2_NC) U234.2(1_NC) U234.4(2_NC) U235.2(1_NC) U235.4(2_NC) U236.2(1_NC) U236.4(2_NC) U237.2(1_NC) U237.4(2_NC) U238.2(1_NC) U238.4(2_NC) U239.2(1_NC) U239.4(2_NC) U240.2(1_NC) U240.4(2_NC) U241.2(1_NC) U241.4(2_NC) U242.2(1_NC) U242.4(2_NC) U246.2(1_NC) U246.4(2_NC) U247.2(1_NC) U247.4(2_NC) U248.2(1_NC) U248.4(2_NC) U249.2(1_NC) U249.4(2_NC) U250.2(1_NC) U250.4(2_NC) U251.2(1_NC) U251.4(2_NC) U252.2(1_NC) U252.4(2_NC) U253.2(1_NC) U253.4(2_NC) U254.2(1_NC) U254.4(2_NC) U255.2(1_NC) U255.4(2_NC) U256.2(1_NC) U256.4(2_NC) U257.2(1_NC) U257.4(2_NC) U258.2(1_NC) U258.4(2_NC) U259.2(1_NC) U259.4(2_NC) U260.2(1_NC) U260.4(2_NC) U261.2(1_NC) U261.4(2_NC) U262.2(1_NC) U262.4(2_NC) U263.2(1_NC) U263.4(2_NC) U264.2(1_NC) U264.4(2_NC) U265.2(1_NC) U265.4(2_NC) U266.2(1_NC) U266.4(2_NC) U267.2(1_NC) U267.4(2_NC) U268.2(1_NC) U268.4(2_NC) U269.2(1_NC) U269.4(2_NC) U270.2(1_NC) U270.4(2_NC) U271.2(1_NC) U271.4(2_NC) U272.2(1_NC) U272.4(2_NC) U273.2(1_NC) U273.4(2_NC) U274.2(1_NC) U274.4(2_NC) U275.2(1_NC) U275.4(2_NC)

## Library data of the parts
J1-J8 = molex_16way:70246-1201; BUILT_BY: EMA_Cory; COPYRIGHT: Copyright (C) 2018 Accelerated Designs. All rights reserved; DATASHEET: https://www.molex.com/pdm_docs/sd/702461602_sd.pdf; MANUFACTURER_PART_NUMBER: 70246-1201; SOURCELIBRARY: Add_to_database_2020-11-05; VENDOR: Molex Connector Corporation
U1-U4 U6 U9-U16 U21-U80 U90-U180 U184-U186 U192-U242 U246-U275 = Murata - MA40H1S-R:MURATA_MA40H1S-R: Ultrasonic Sensor SMD Embossed T/R 40kHz; AUTOMOTIVE: No; CENTROID_NOT_SPECIFIED: No; DATASHEET: https://www.murata.com/products/productdata/8797589176350/MASPSMDE.pdf?1565100009000; DEVICE_CLASS_L1: Sensors; DEVICE_CLASS_L2: Proximity Sensors; DEVICE_CLASS_L3: unset; DIGIKEY_DESCRIPTION: ULTRASONIC TRANSDUCER; DIGIKEY_PART_NUMBER: 490-MA40H1S-RCT-ND; FOOTPRINT_VARIANT_NAME_0: Recommended_Land_Pattern; FREQUENCY: 40kHz; HEIGHT: 1.25mm; LEAD_FREE: Yes; MAX_SUPPLY_VOLTAGE: 7.2V; MF: Murata; MFG_PACKAGE_IDENT: 0; MFG_PACKAGE_IDENT_DATE: 0; MFG_PACKAGE_IDENT_REV: 0; MOUSER_PART_NUMBER: 81-MA40H1S-R; MPN: MA40H1S-R; PACKAGE: SMT_5MM2_5MM2; PREFIX: U; ROHS: Yes; SENSING_METHOD: Ultrasonic; TEMPERATURE_RANGE_HIGH: +60°C; TEMPERATURE_RANGE_LOW: -20°C; VERIFICATION_VERSION: 0.0.0.3